# EasyEDA Pro project Car.eprj

# Schematic Schematic1
Board Name: Board1; Create Date: 2024-10-10
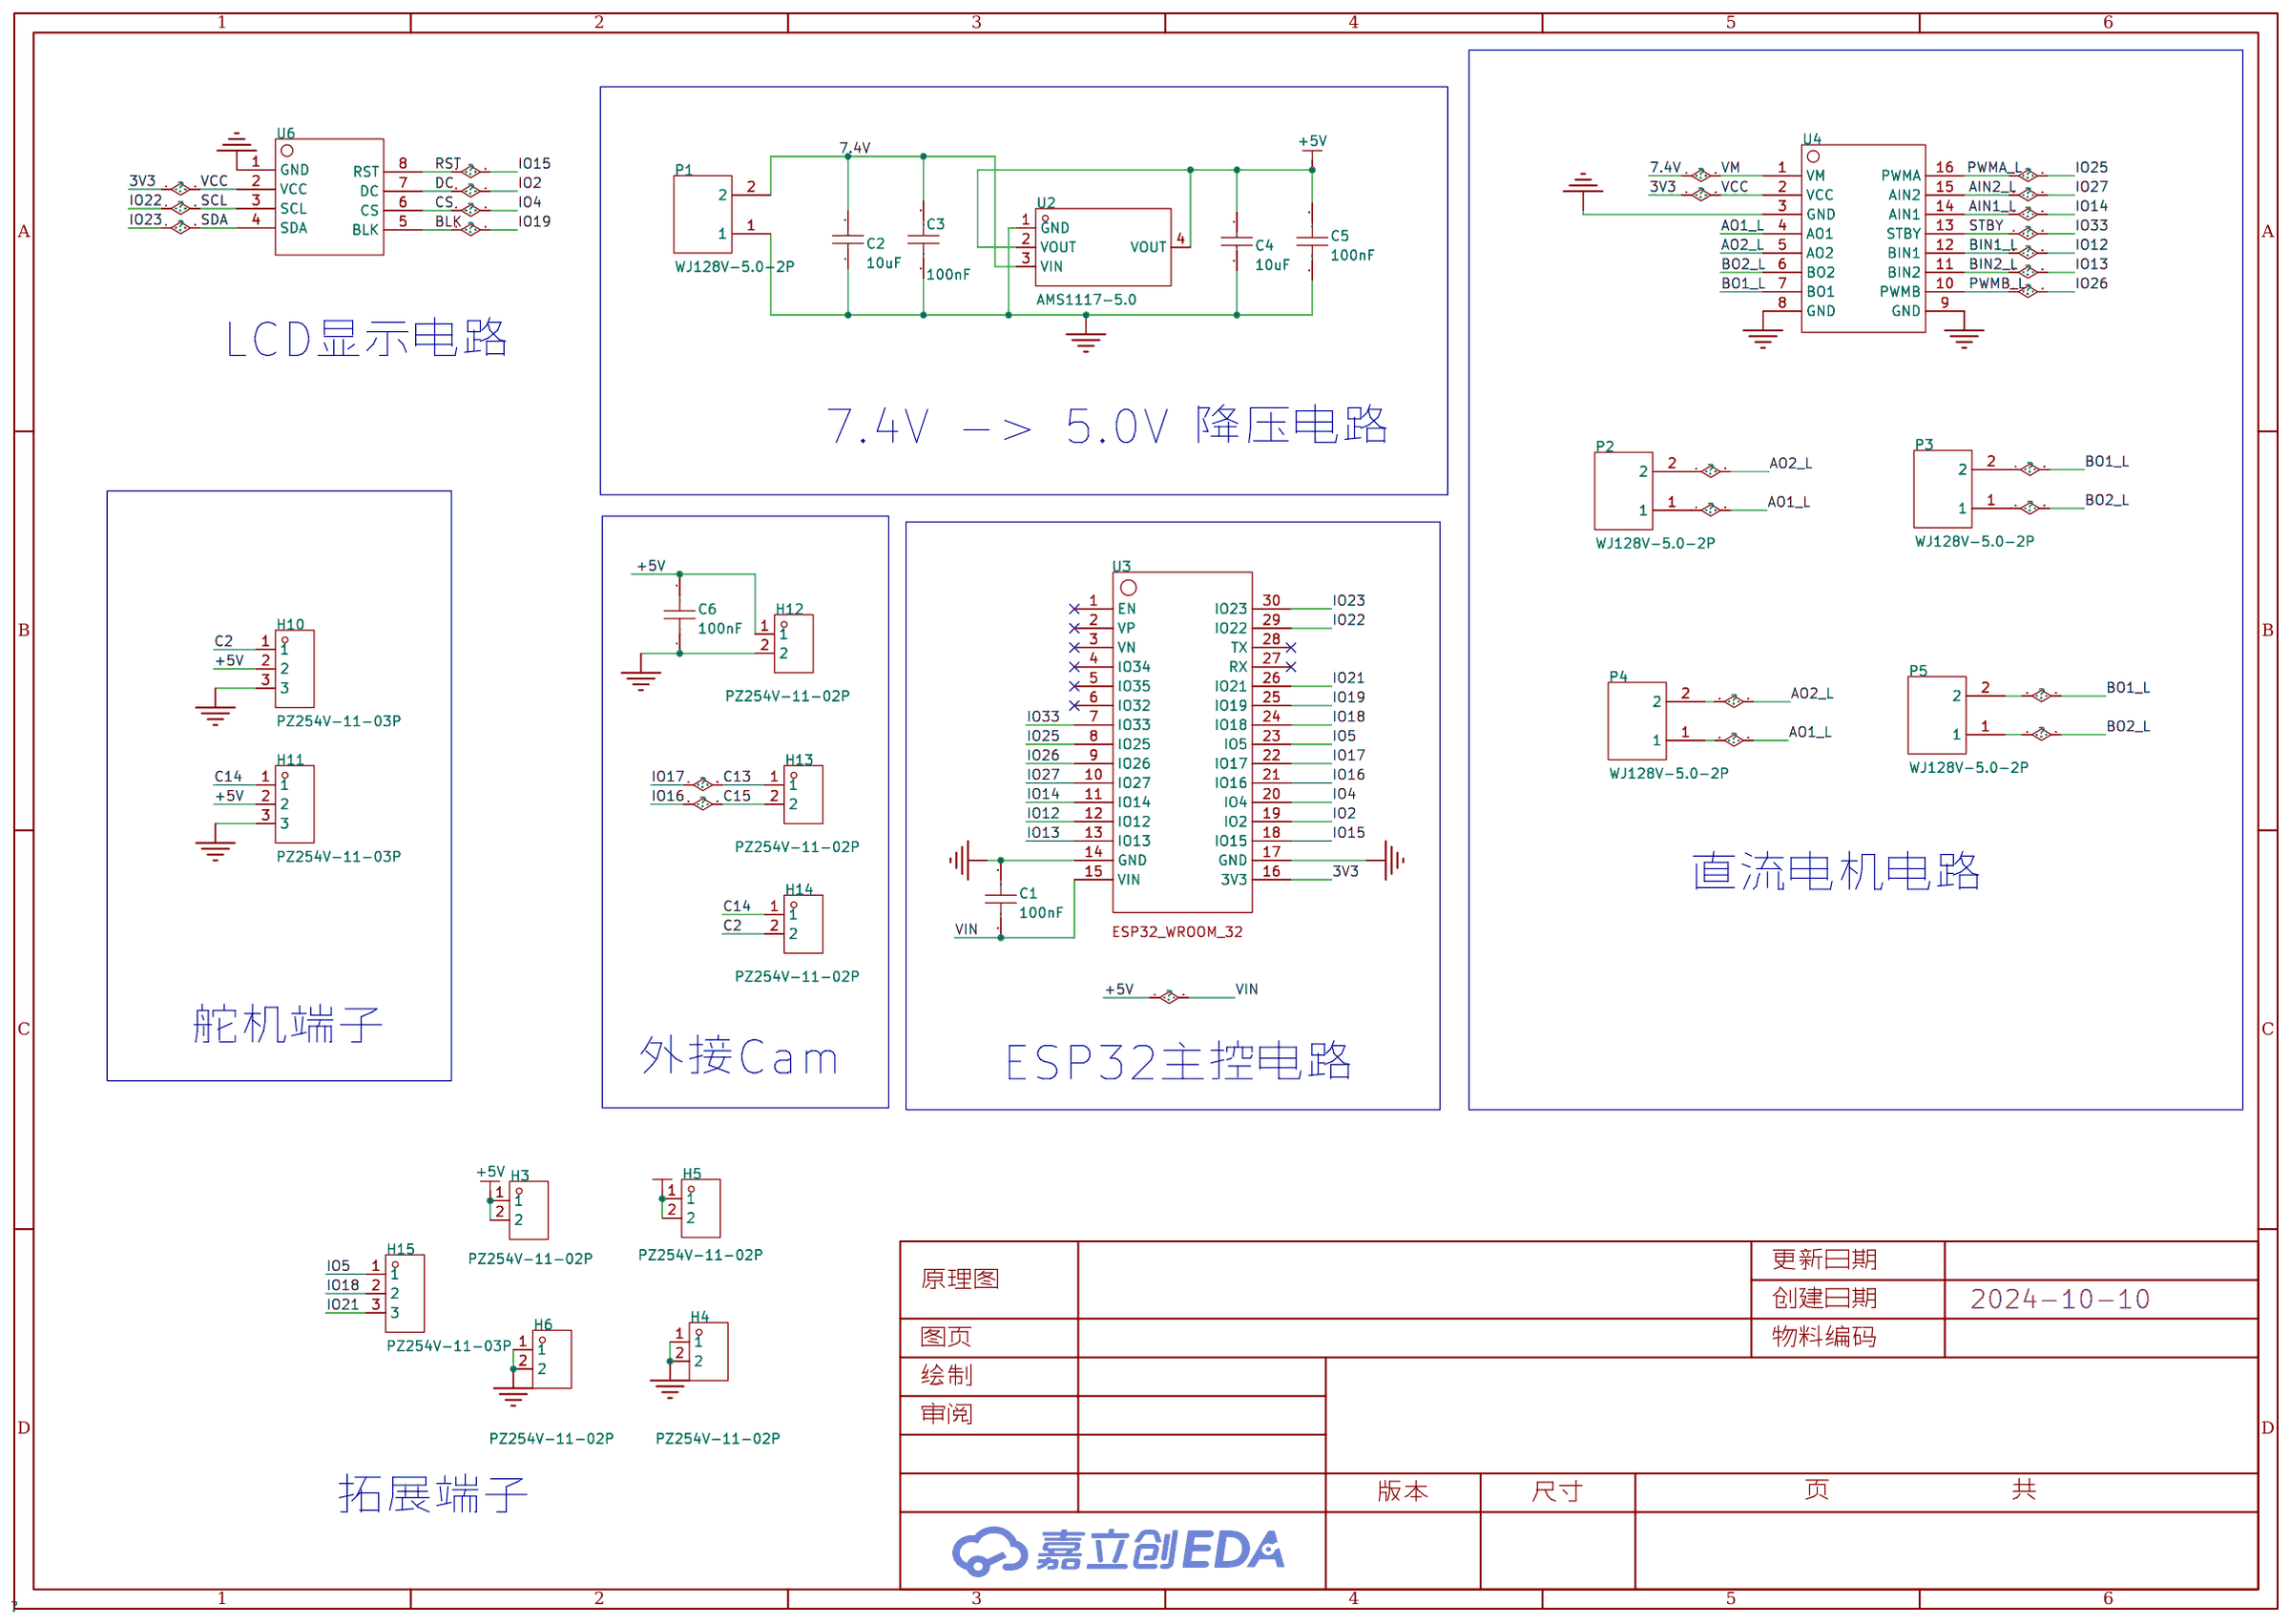
[diagram p0: schematic sheet]

## Parts
C1  100nF  [C0603]
C2  10uF  [C0805]
C3  100nF  [C0603]
C4  10uF  [C0805]
C5  100nF  [C0603]
C6  100nF  [C0603]
H3  PZ254V-11-02P  [HDR-TH_2P-P2.54-V-M]
H4  PZ254V-11-02P  [HDR-TH_2P-P2.54-V-M]
H5  PZ254V-11-02P  [HDR-TH_2P-P2.54-V-M]
H6  PZ254V-11-02P  [HDR-TH_2P-P2.54-V-M]
H10  PZ254V-11-03P  [HDR-TH_3P-P2.54-V-M]
H11  PZ254V-11-03P  [HDR-TH_3P-P2.54-V-M]
H12  PZ254V-11-02P  [HDR-TH_2P-P2.54-V-M]
H13  PZ254V-11-02P  [HDR-TH_2P-P2.54-V-M]
H14  PZ254V-11-02P  [HDR-TH_2P-P2.54-V-M]
H15  PZ254V-11-03P  [HDR-TH_3P-P2.54-V-M]
P1  WJ128V-5.0-2P  [CONN-TH_2P-P5.00_WJ128V-5.0-2P]
P2  WJ128V-5.0-2P  [CONN-TH_2P-P5.00_WJ128V-5.0-2P]
P3  WJ128V-5.0-2P  [CONN-TH_2P-P5.00_WJ128V-5.0-2P]
P4  WJ128V-5.0-2P  [CONN-TH_2P-P5.00_WJ128V-5.0-2P]
P5  WJ128V-5.0-2P  [CONN-TH_2P-P5.00_WJ128V-5.0-2P]
U2  AMS1117-5.0  [SOT-223_L6.5-W3.5-P2.30-LS7.0-BR]
U3  -  [ESP32_WROOM_32]
U4  -  [TB6612fng]
U6  -  [ST7735]

## Library data of the parts
C1 C3 C5 C6 = CGA0603X7R104K500JT: 容值:100nF;精度:±10%;额定电压:50V;材质(温度系数):X7R;; LCSC Part Name: 100nF ±10% 50V; Supplier Part: C6119867; Manufacturer: HRE(芯声); Supplier Footprint: 0603; JLCPCB Part Class: 扩展库; Supplier: LCSC; Tolerance: ±10%; Voltage Rated: 50V; Temperature Coefficient: X7R
C2 C4 = CL21A106KPFNNNE: 容值:10uF;精度:±10%;额定电压:10V;材质(温度系数):X5R;; LCSC Part Name: 10uF ±10% 10V; Supplier Part: C17024; Manufacturer: SAMSUNG(三星); Supplier Footprint: 0805; JLCPCB Part Class: 扩展库; Datasheet: https://atta.szlcsc.com/upload/public/pdf/source/20160218/1457707763339.pdf; Supplier: LCSC; Tolerance: ±10%; Voltage Rated: 10V; Temperature Coefficient: X5R
H3-H6 H12-H14 = PZ254V-11-02P: LCSC Part Name: 间距:2.54mm 1x2P 直插 方针; Supplier Part: C492401; Manufacturer: XFCN(兴飞); Supplier Footprint: 插件,P=2.54mm; Datasheet: https://atta.szlcsc.com/upload/public/pdf/source/20200309/C492401_A812433581A9B211A7FFA413ADDFF0E5.pdf; Supplier: LCSC; Pin Structure: 1x2P; Pitch: 2.54mm; Circluar Pins/Square Pins: 方针; Mounting Type: 直插; Number of Rows: 单排; Number of Pins: 2P; Length of Mating Pin: 6mm; Insulation Height: 2.5mm; Length of End Connection Pin: 3mm; Contact Material: 黄铜; Operating Temperature Range: -40℃~+105℃; Color: 黑色
H10 H11 H15 = PZ254V-11-03P: LCSC Part Name: 间距:2.54mm 1x3P 直插 方针; Supplier Part: C2937625; Manufacturer: XFCN(兴飞); Supplier Footprint: 插件,P=2.54mm; JLCPCB Part Class: 扩展库; Datasheet: https://atta.szlcsc.com/upload/public/pdf/source/20200309/C492402_8335C3D49C4E4C618838D59BB1D024C1.pdf; Supplier: LCSC; Pin Structure: 1x3P; Pitch: 2.54mm; Circluar Pins/Square Pins: 方针; Mounting Type: 直插; Number of Rows: 单排; Number of Pins: 3P; Current Rating (Max): 3A; Voltage Rating (Max): 250V; Length of Mating Pin: 6mm; Insulation Height: 2.5mm; Length of End Connection Pin: 3mm; Operating Temperature Range: -40℃~+105℃; Color: 黑色
P1-P5 = WJ128V-5.0-2P: LCSC Part Name: 5mm 1x2P 排数:1 每排P数:2 直插; Supplier Part: C8269; Manufacturer: KANGNEX(康奈克斯电气); Supplier Footprint: 插件,P=5mm; Datasheet: https://atta.szlcsc.com/upload/public/pdf/source/20191225/C8269_1FF44D6D2E83DB14A7CA266A410FD9AD.pdf; Supplier: LCSC; Structure: 1x2P; Pitch: 5mm; Color: 绿色; Mounting Style: 直插; Current Rating (Max): 20A; Voltage Rating (Max): 250V; Number of Pins: 2P; Number of Rows: 1; Wire Gauge - AWG: 12~22; Wire Gauge - mm2: 2.5; Number of PINs Per Row: 2; Operating Temperature Range: -40℃~+105℃
U2 = AMS1117-5.0_C6187: LCSC Part Name: 输入12V 输出5V 1A; Supplier Part: C6187; Manufacturer: AMS; Supplier Footprint: SOT-223; Datasheet: https://atta.szlcsc.com/upload/public/pdf/source/20230918/E4B716057EE82179D88E8A0894830D59.pdf; Supplier: LCSC; Output Type: 固定; Maximum Input Voltage: 12V; Output Voltage: 5V; MAX Output Current: 1A; Power Supply Rejection Ratio (PSRR): 68dB@(120Hz); Dropout Voltage: 1.3V@(1A); Output Polarity: 正极; Number of Outputs: 1
U3 = ESP32_WROOM_32
U4 = TB6612fng
U6 = ST7735

## Nets
3V3: H5.1 H5.2 U3.16(3V3) U4.2(VCC) U6.2(VCC)
7.4V: C2.2 C3.2 P1.2 U2.3(VIN) U4.1(VM)
+5V: C1.1 C4.2 C5.2 C6.2 H3.1 H3.2 H10.2 H11.2 H12.1 U2.2(VOUT) U2.4(VOUT) U3.15(VIN)
GND: C1.2 C2.1 C3.1 C4.1 C5.1 C6.1 H4.1 H4.2 H6.1 H6.2 H10.3 H11.3 H12.2 P1.1 U2.1(GND) U3.14(GND) U3.17(GND) U4.3(GND) U4.8(GND) U4.9(GND) U6.1(GND)
AIN1_L: U3.11(IO14) U4.14(AIN1)
AIN2_L: U3.10(IO27) U4.15(AIN2)
AO1_L: P2.1 P4.1 U4.4(AO1)
AO2_L: P2.2 P4.2 U4.5(AO2)
BIN1_L: U3.12(IO12) U4.12(BIN1)
BIN2_L: U3.13(IO13) U4.11(BIN2)
BLK: U3.25(IO19) U6.5(BLK)
BO1_L: P3.2 P5.2 U4.7(BO1)
BO2_L: P3.1 P5.1 U4.6(BO2)
C2: H10.1 H14.2
C13: H13.1 U3.22(IO17)
C14: H11.1 H14.1
C15: H13.2 U3.21(IO16)
CS: U3.20(IO4) U6.6(CS)
DC: U3.19(IO2) U6.7(DC)
IO5: H15.1 U3.23(IO5)
IO15: U3.18(IO15) U6.8(RST)
IO18: H15.2 U3.24(IO18)
IO21: H15.3 U3.26(IO21)
IO22: U3.29(IO22) U6.3(SCL)
IO23: U3.30(IO23) U6.4(SDA)
IO25: U3.8(IO25) U4.16(PWMA)
IO26: U3.9(IO26) U4.10(PWMB)
IO33: U3.7(IO33) U4.13(STBY)

Not connected (* = marked no-connect by the designer): U3 1(EN)* 2(VP)* 3(VN)* 4(IO34)* 5(IO35)* 6(IO32)* 27(RX)* 28(TX)*

## Notes on the sheet
- LCD显示电路
- 7.4V -> 5.0V 降压电路
- 直流电机电路
- 舵机端子
- 外接Cam
- ESP32主控电路
- 拓展端子

# Schematic Schematic1_1
Board Name: Board1; Create Date: 2024-10-10
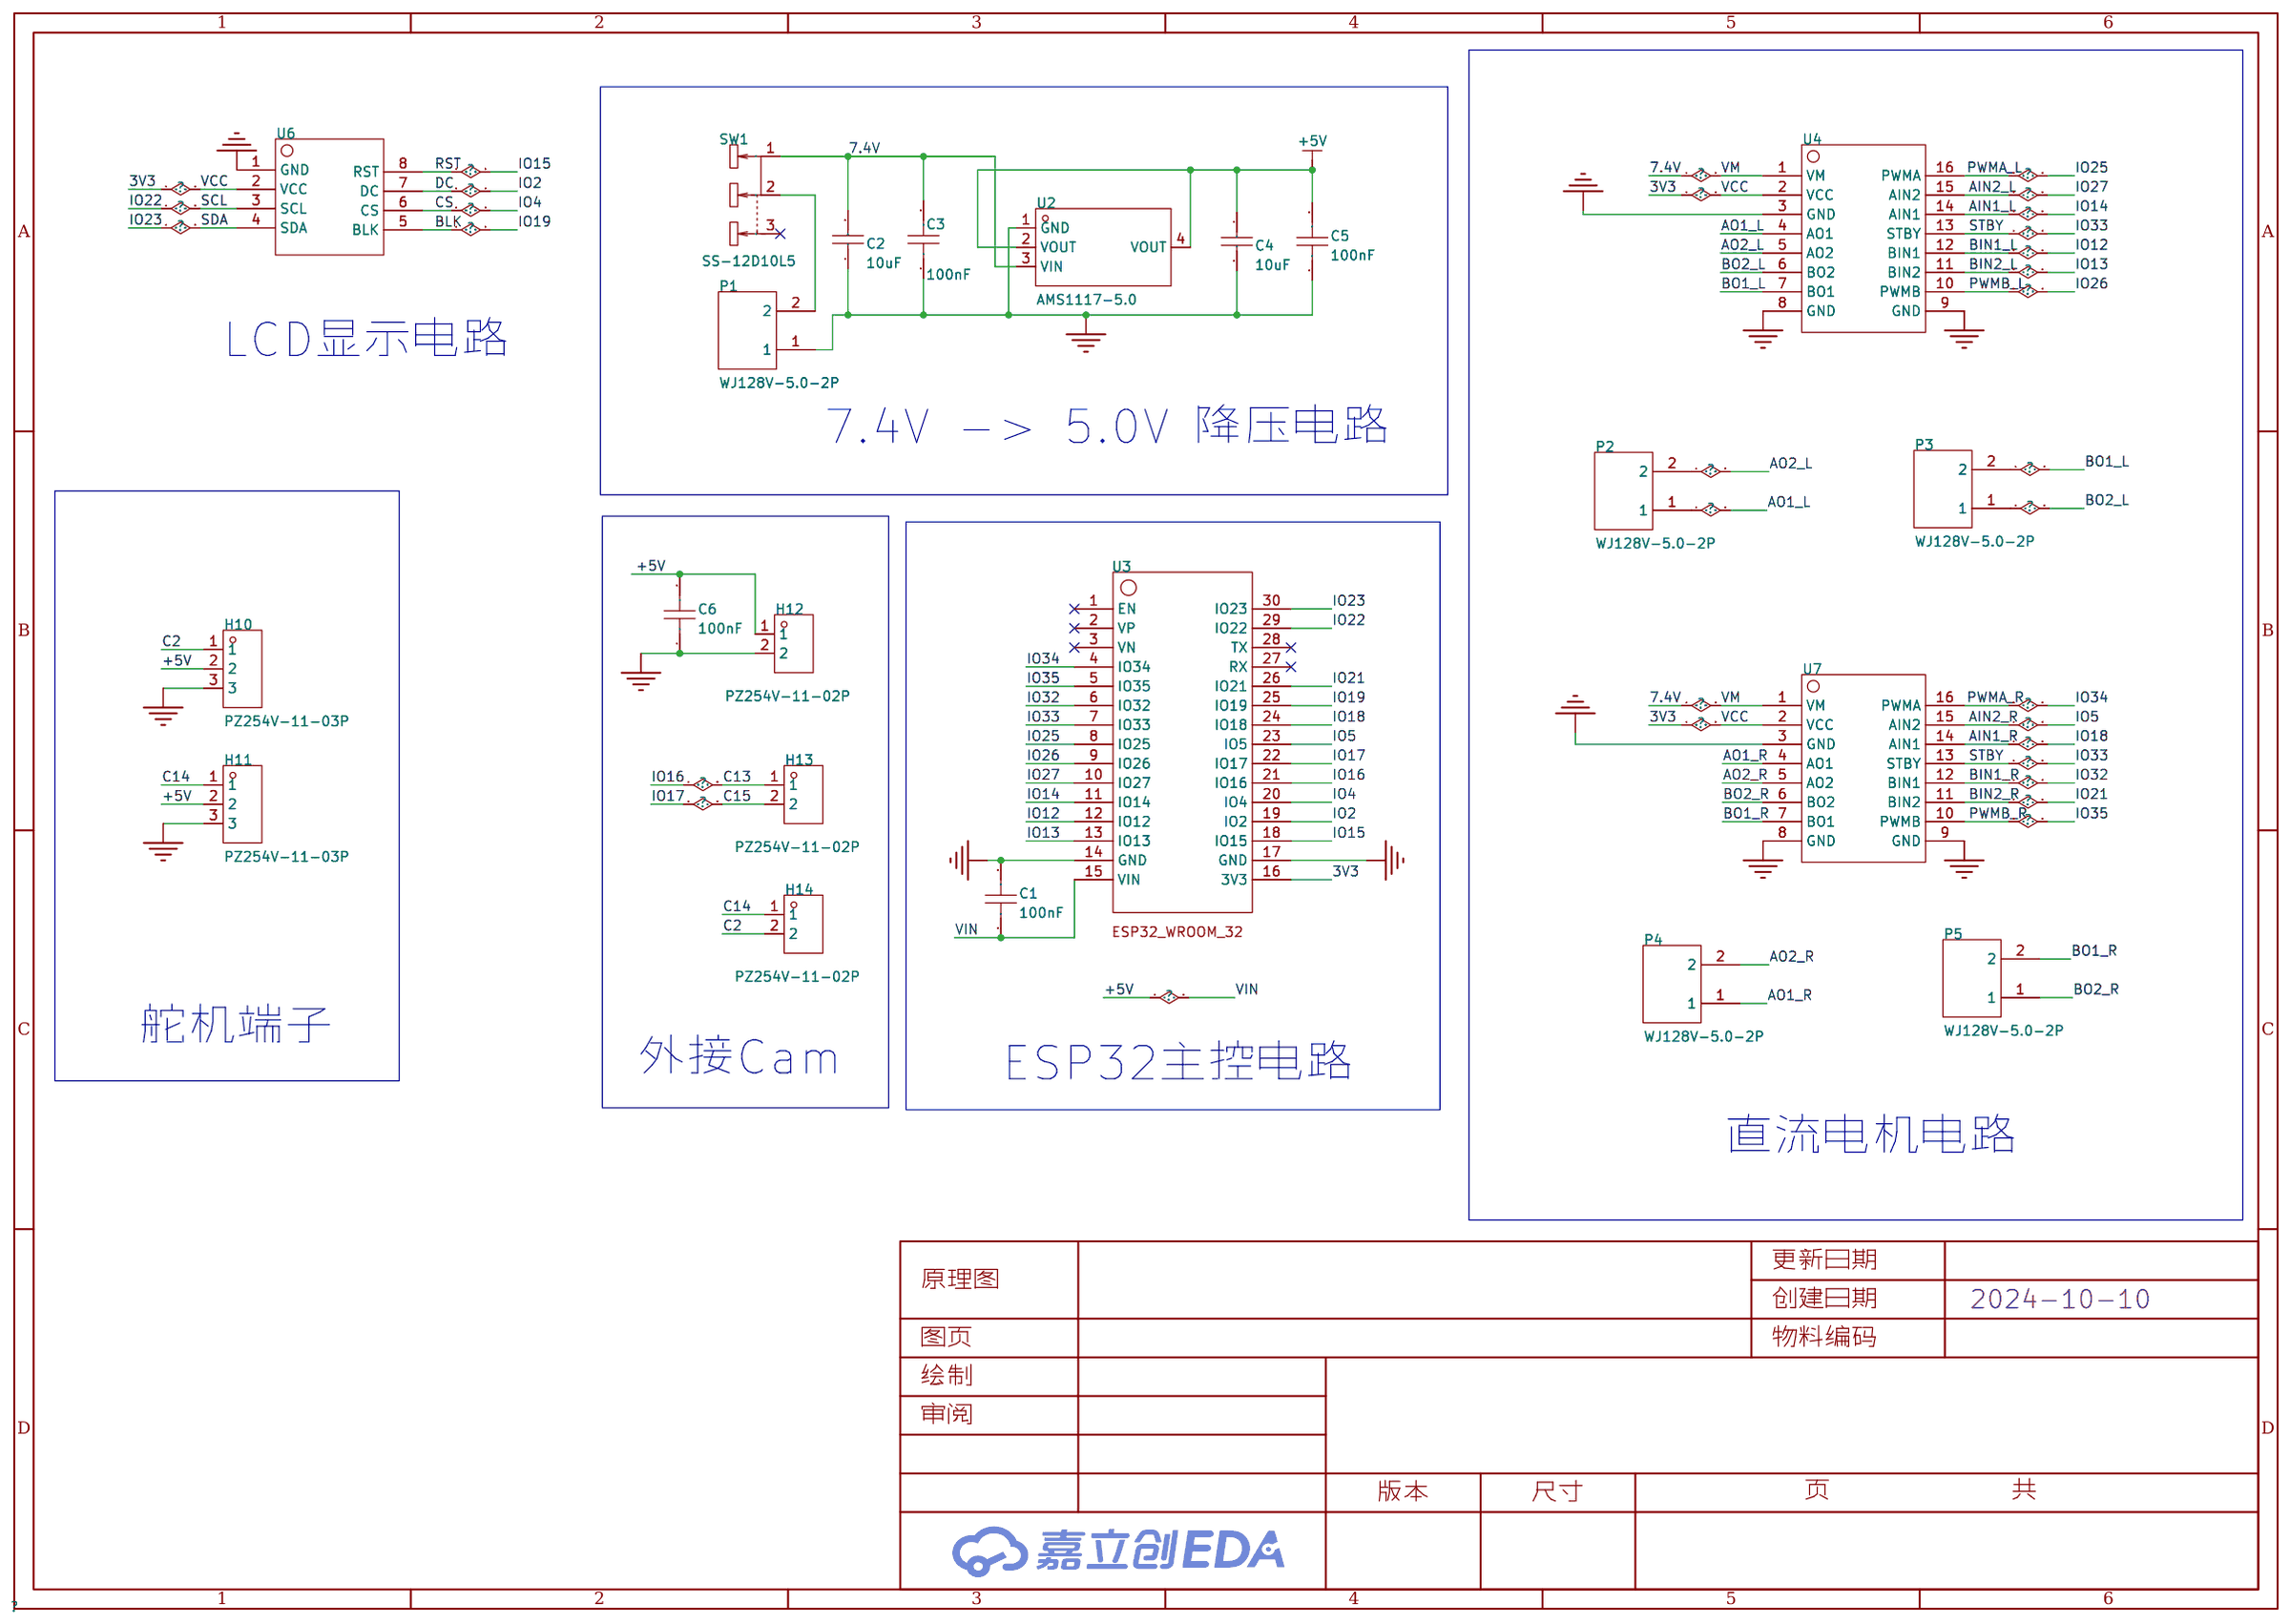
[diagram p1: schematic sheet]

## Parts
C1  100nF  [C0603]
C2  10uF  [C0805]
C3  100nF  [C0603]
C4  10uF  [C0805]
C5  100nF  [C0603]
C6  100nF  [C0603]
H10  PZ254V-11-03P  [HDR-TH_3P-P2.54-V-M]
H11  PZ254V-11-03P  [HDR-TH_3P-P2.54-V-M]
H12  PZ254V-11-02P  [HDR-TH_2P-P2.54-V-M]
H13  PZ254V-11-02P  [HDR-TH_2P-P2.54-V-M]
H14  PZ254V-11-02P  [HDR-TH_2P-P2.54-V-M]
P1  WJ128V-5.0-2P  [CONN-TH_2P-P5.00_WJ128V-5.0-2P]
P2  WJ128V-5.0-2P  [CONN-TH_2P-P5.00_WJ128V-5.0-2P]
P3  WJ128V-5.0-2P  [CONN-TH_2P-P5.00_WJ128V-5.0-2P]
P4  WJ128V-5.0-2P  [CONN-TH_2P-P5.00_WJ128V-5.0-2P]
P5  WJ128V-5.0-2P  [CONN-TH_2P-P5.00_WJ128V-5.0-2P]
SW1  SS-12D10L5  [SW-TH_SS-12D10L5]
U2  AMS1117-5.0  [SOT-223_L6.5-W3.5-P2.30-LS7.0-BR]
U3  -  [ESP32_WROOM_32]
U4  -  [TB6612fng]
U6  -  [ST7735]
U7  -  [TB6612fng]

## Library data of the parts
C1 C3 C5 C6 = CGA0603X7R104K500JT: 容值:100nF;精度:±10%;额定电压:50V;材质(温度系数):X7R;; LCSC Part Name: 100nF ±10% 50V; Supplier Part: C6119867; Manufacturer: HRE(芯声); Supplier Footprint: 0603; JLCPCB Part Class: 扩展库; Supplier: LCSC; Tolerance: ±10%; Voltage Rated: 50V; Temperature Coefficient: X7R
C2 C4 = CL21A106KPFNNNE: 容值:10uF;精度:±10%;额定电压:10V;材质(温度系数):X5R;; LCSC Part Name: 10uF ±10% 10V; Supplier Part: C17024; Manufacturer: SAMSUNG(三星); Supplier Footprint: 0805; JLCPCB Part Class: 扩展库; Datasheet: https://atta.szlcsc.com/upload/public/pdf/source/20160218/1457707763339.pdf; Supplier: LCSC; Tolerance: ±10%; Voltage Rated: 10V; Temperature Coefficient: X5R
H10 H11 = PZ254V-11-03P: LCSC Part Name: 间距:2.54mm 1x3P 直插 方针; Supplier Part: C2937625; Manufacturer: XFCN(兴飞); Supplier Footprint: 插件,P=2.54mm; JLCPCB Part Class: 扩展库; Datasheet: https://atta.szlcsc.com/upload/public/pdf/source/20200309/C492402_8335C3D49C4E4C618838D59BB1D024C1.pdf; Supplier: LCSC; Pin Structure: 1x3P; Pitch: 2.54mm; Circluar Pins/Square Pins: 方针; Mounting Type: 直插; Number of Rows: 单排; Number of Pins: 3P; Current Rating (Max): 3A; Voltage Rating (Max): 250V; Length of Mating Pin: 6mm; Insulation Height: 2.5mm; Length of End Connection Pin: 3mm; Operating Temperature Range: -40℃~+105℃; Color: 黑色
H12-H14 = PZ254V-11-02P: LCSC Part Name: 间距:2.54mm 1x2P 直插 方针; Supplier Part: C492401; Manufacturer: XFCN(兴飞); Supplier Footprint: 插件,P=2.54mm; Datasheet: https://atta.szlcsc.com/upload/public/pdf/source/20200309/C492401_A812433581A9B211A7FFA413ADDFF0E5.pdf; Supplier: LCSC; Pin Structure: 1x2P; Pitch: 2.54mm; Circluar Pins/Square Pins: 方针; Mounting Type: 直插; Number of Rows: 单排; Number of Pins: 2P; Length of Mating Pin: 6mm; Insulation Height: 2.5mm; Length of End Connection Pin: 3mm; Contact Material: 黄铜; Operating Temperature Range: -40℃~+105℃; Color: 黑色
P1-P5 = WJ128V-5.0-2P: LCSC Part Name: 5mm 1x2P 排数:1 每排P数:2 直插; Supplier Part: C8269; Manufacturer: KANGNEX(康奈克斯电气); Supplier Footprint: 插件,P=5mm; Datasheet: https://atta.szlcsc.com/upload/public/pdf/source/20191225/C8269_1FF44D6D2E83DB14A7CA266A410FD9AD.pdf; Supplier: LCSC; Structure: 1x2P; Pitch: 5mm; Color: 绿色; Mounting Style: 直插; Current Rating (Max): 20A; Voltage Rating (Max): 250V; Number of Pins: 2P; Number of Rows: 1; Wire Gauge - AWG: 12~22; Wire Gauge - mm2: 2.5; Number of PINs Per Row: 2; Operating Temperature Range: -40℃~+105℃
SW1 = SS-12D10L5: LCSC Part Name: 柄长5mm 直插双档 滑动开关; Supplier Part: C319012; Manufacturer: XKB Connectivity(中国星坤); Supplier Footprint: 插件; Datasheet: https://atta.szlcsc.com/upload/public/pdf/source/20211009/D6412F37AABE6F9459A6EE7FA4DAEADB.pdf; Supplier: LCSC; Circuit: 单刀双掷; Actuator Style: 矩形柱状; Pin Style: PC引脚; Switch Length: 13mm; Switch Width: 6.8mm; Switch Height: 6.4mm; Mounting Style: 直插; Actuator Color: 黑色; Current Rating (DC): 3A; Voltage Rating (DC): 125V; Current Rating (AC): 3A; Voltage Rating (AC): 125V; Mechanical Life: 1万次; Operating Temperature: -40℃~+85℃
U2 = AMS1117-5.0_C6187: LCSC Part Name: 输入12V 输出5V 1A; Supplier Part: C6187; Manufacturer: AMS; Supplier Footprint: SOT-223; Datasheet: https://atta.szlcsc.com/upload/public/pdf/source/20230918/E4B716057EE82179D88E8A0894830D59.pdf; Supplier: LCSC; Output Type: 固定; Maximum Input Voltage: 12V; Output Voltage: 5V; MAX Output Current: 1A; Power Supply Rejection Ratio (PSRR): 68dB@(120Hz); Dropout Voltage: 1.3V@(1A); Output Polarity: 正极; Number of Outputs: 1
U3 = ESP32_WROOM_32
U4 U7 = TB6612fng
U6 = ST7735

## Nets
3V3: U3.16(3V3) U4.2(VCC) U6.2(VCC) U7.2(VCC)
7.4V: C2.2 C3.2 SW1.1 U2.3(VIN) U4.1(VM) U7.1(VM)
+5V: C1.1 C4.2 C5.2 C6.2 H10.2 H11.2 H12.1 U2.2(VOUT) U2.4(VOUT) U3.15(VIN)
GND: C1.2 C2.1 C3.1 C4.1 C5.1 C6.1 H10.3 H11.3 H12.2 P1.1 U2.1(GND) U3.14(GND) U3.17(GND) U4.3(GND) U4.8(GND) U4.9(GND) U6.1(GND) U7.3(GND) U7.8(GND) U7.9(GND)
AIN1_L: U3.11(IO14) U4.14(AIN1)
AIN1_R: U3.24(IO18) U7.14(AIN1)
AIN2_L: U3.10(IO27) U4.15(AIN2)
AIN2_R: U3.23(IO5) U7.15(AIN2)
AO1_L: P2.1 U4.4(AO1)
AO1_R: P4.1 U7.4(AO1)
AO2_L: P2.2 U4.5(AO2)
AO2_R: P4.2 U7.5(AO2)
BIN1_L: U3.12(IO12) U4.12(BIN1)
BIN1_R: U3.6(IO32) U7.12(BIN1)
BIN2_L: U3.13(IO13) U4.11(BIN2)
BIN2_R: U3.26(IO21) U7.11(BIN2)
BLK: U3.25(IO19) U6.5(BLK)
BO1_L: P3.2 U4.7(BO1)
BO1_R: P5.2 U7.7(BO1)
BO2_L: P3.1 U4.6(BO2)
BO2_R: P5.1 U7.6(BO2)
C2: H10.1 H14.2
C13: H13.1 U3.21(IO16)
C14: H11.1 H14.1
C15: H13.2 U3.22(IO17)
CS: U3.20(IO4) U6.6(CS)
DC: U3.19(IO2) U6.7(DC)
IO15: U3.18(IO15) U6.8(RST)
IO22: U3.29(IO22) U6.3(SCL)
IO23: U3.30(IO23) U6.4(SDA)
IO25: U3.8(IO25) U4.16(PWMA)
IO26: U3.9(IO26) U4.10(PWMB)
IO33: U3.7(IO33) U4.13(STBY) U7.13(STBY)
IO34: U3.4(IO34) U7.16(PWMA)
IO35: U3.5(IO35) U7.10(PWMB)
$1N1319: P1.2 SW1.2

Not connected (* = marked no-connect by the designer): SW1 3*; U3 1(EN)* 2(VP)* 3(VN)* 27(RX)* 28(TX)*

## Notes on the sheet
- LCD显示电路
- 7.4V -> 5.0V 降压电路
- 舵机端子
- 外接Cam
- ESP32主控电路
- 直流电机电路

# Board PCB1
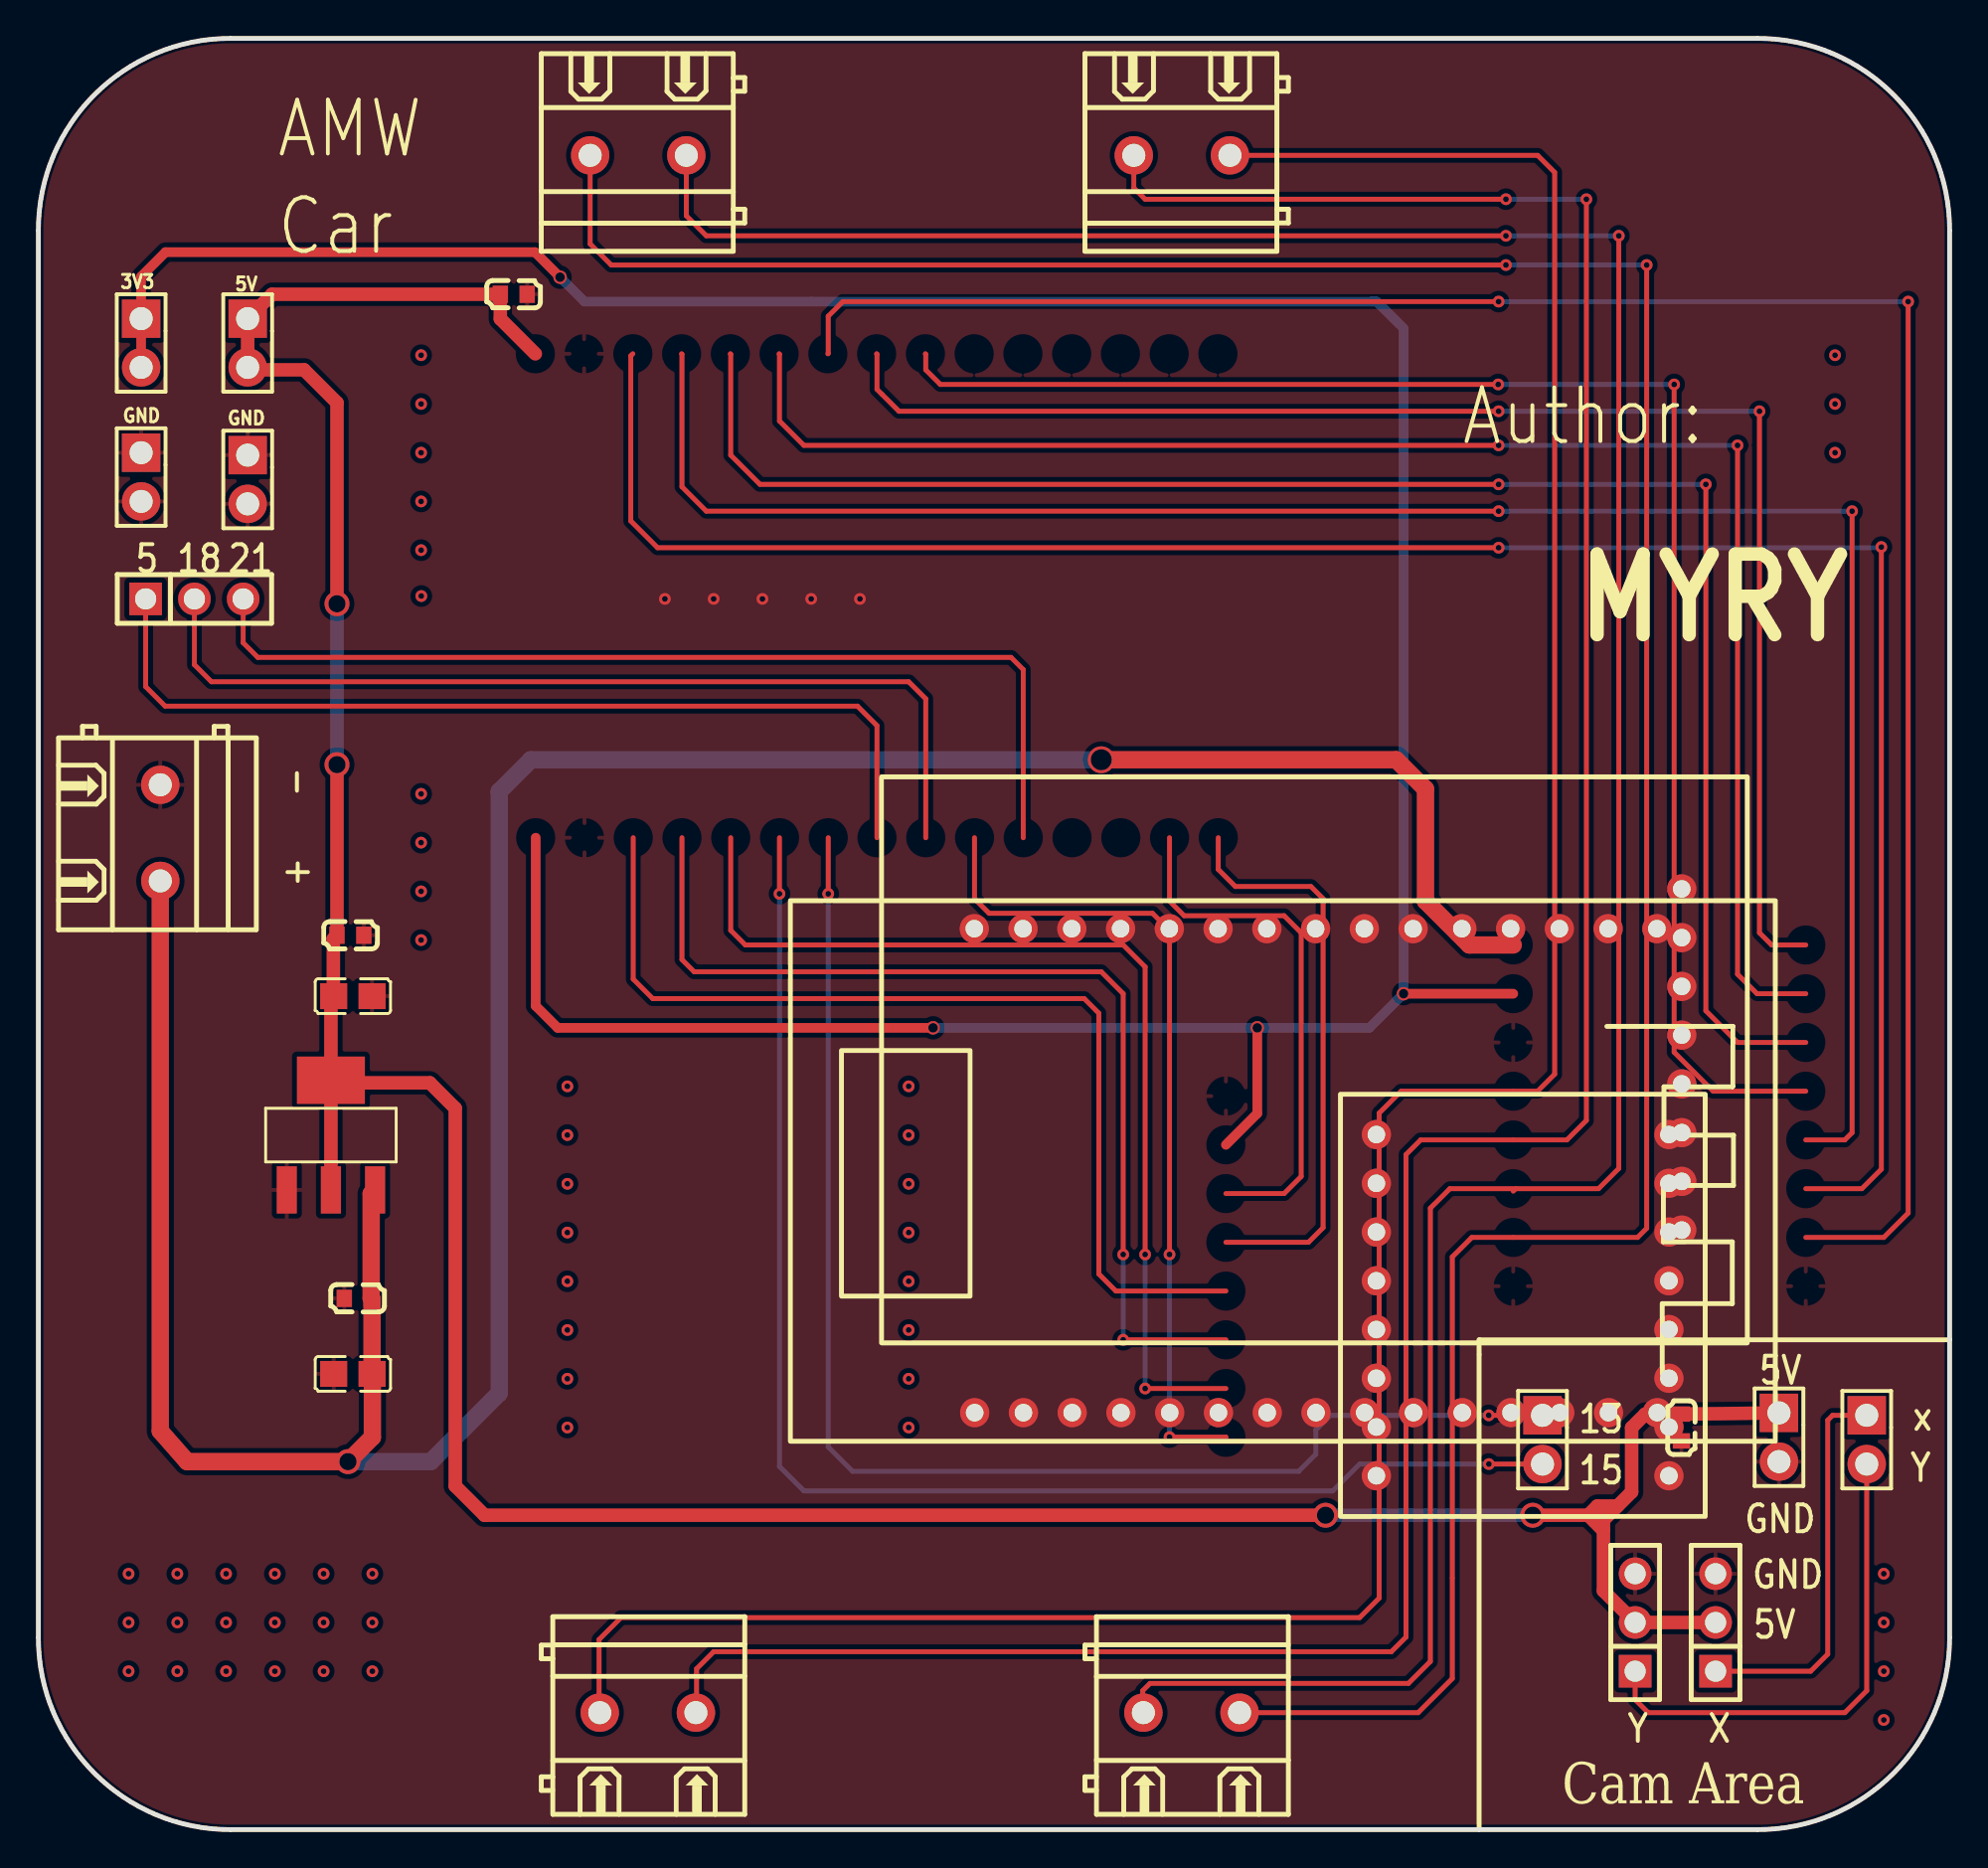
[diagram p2: board, top side]
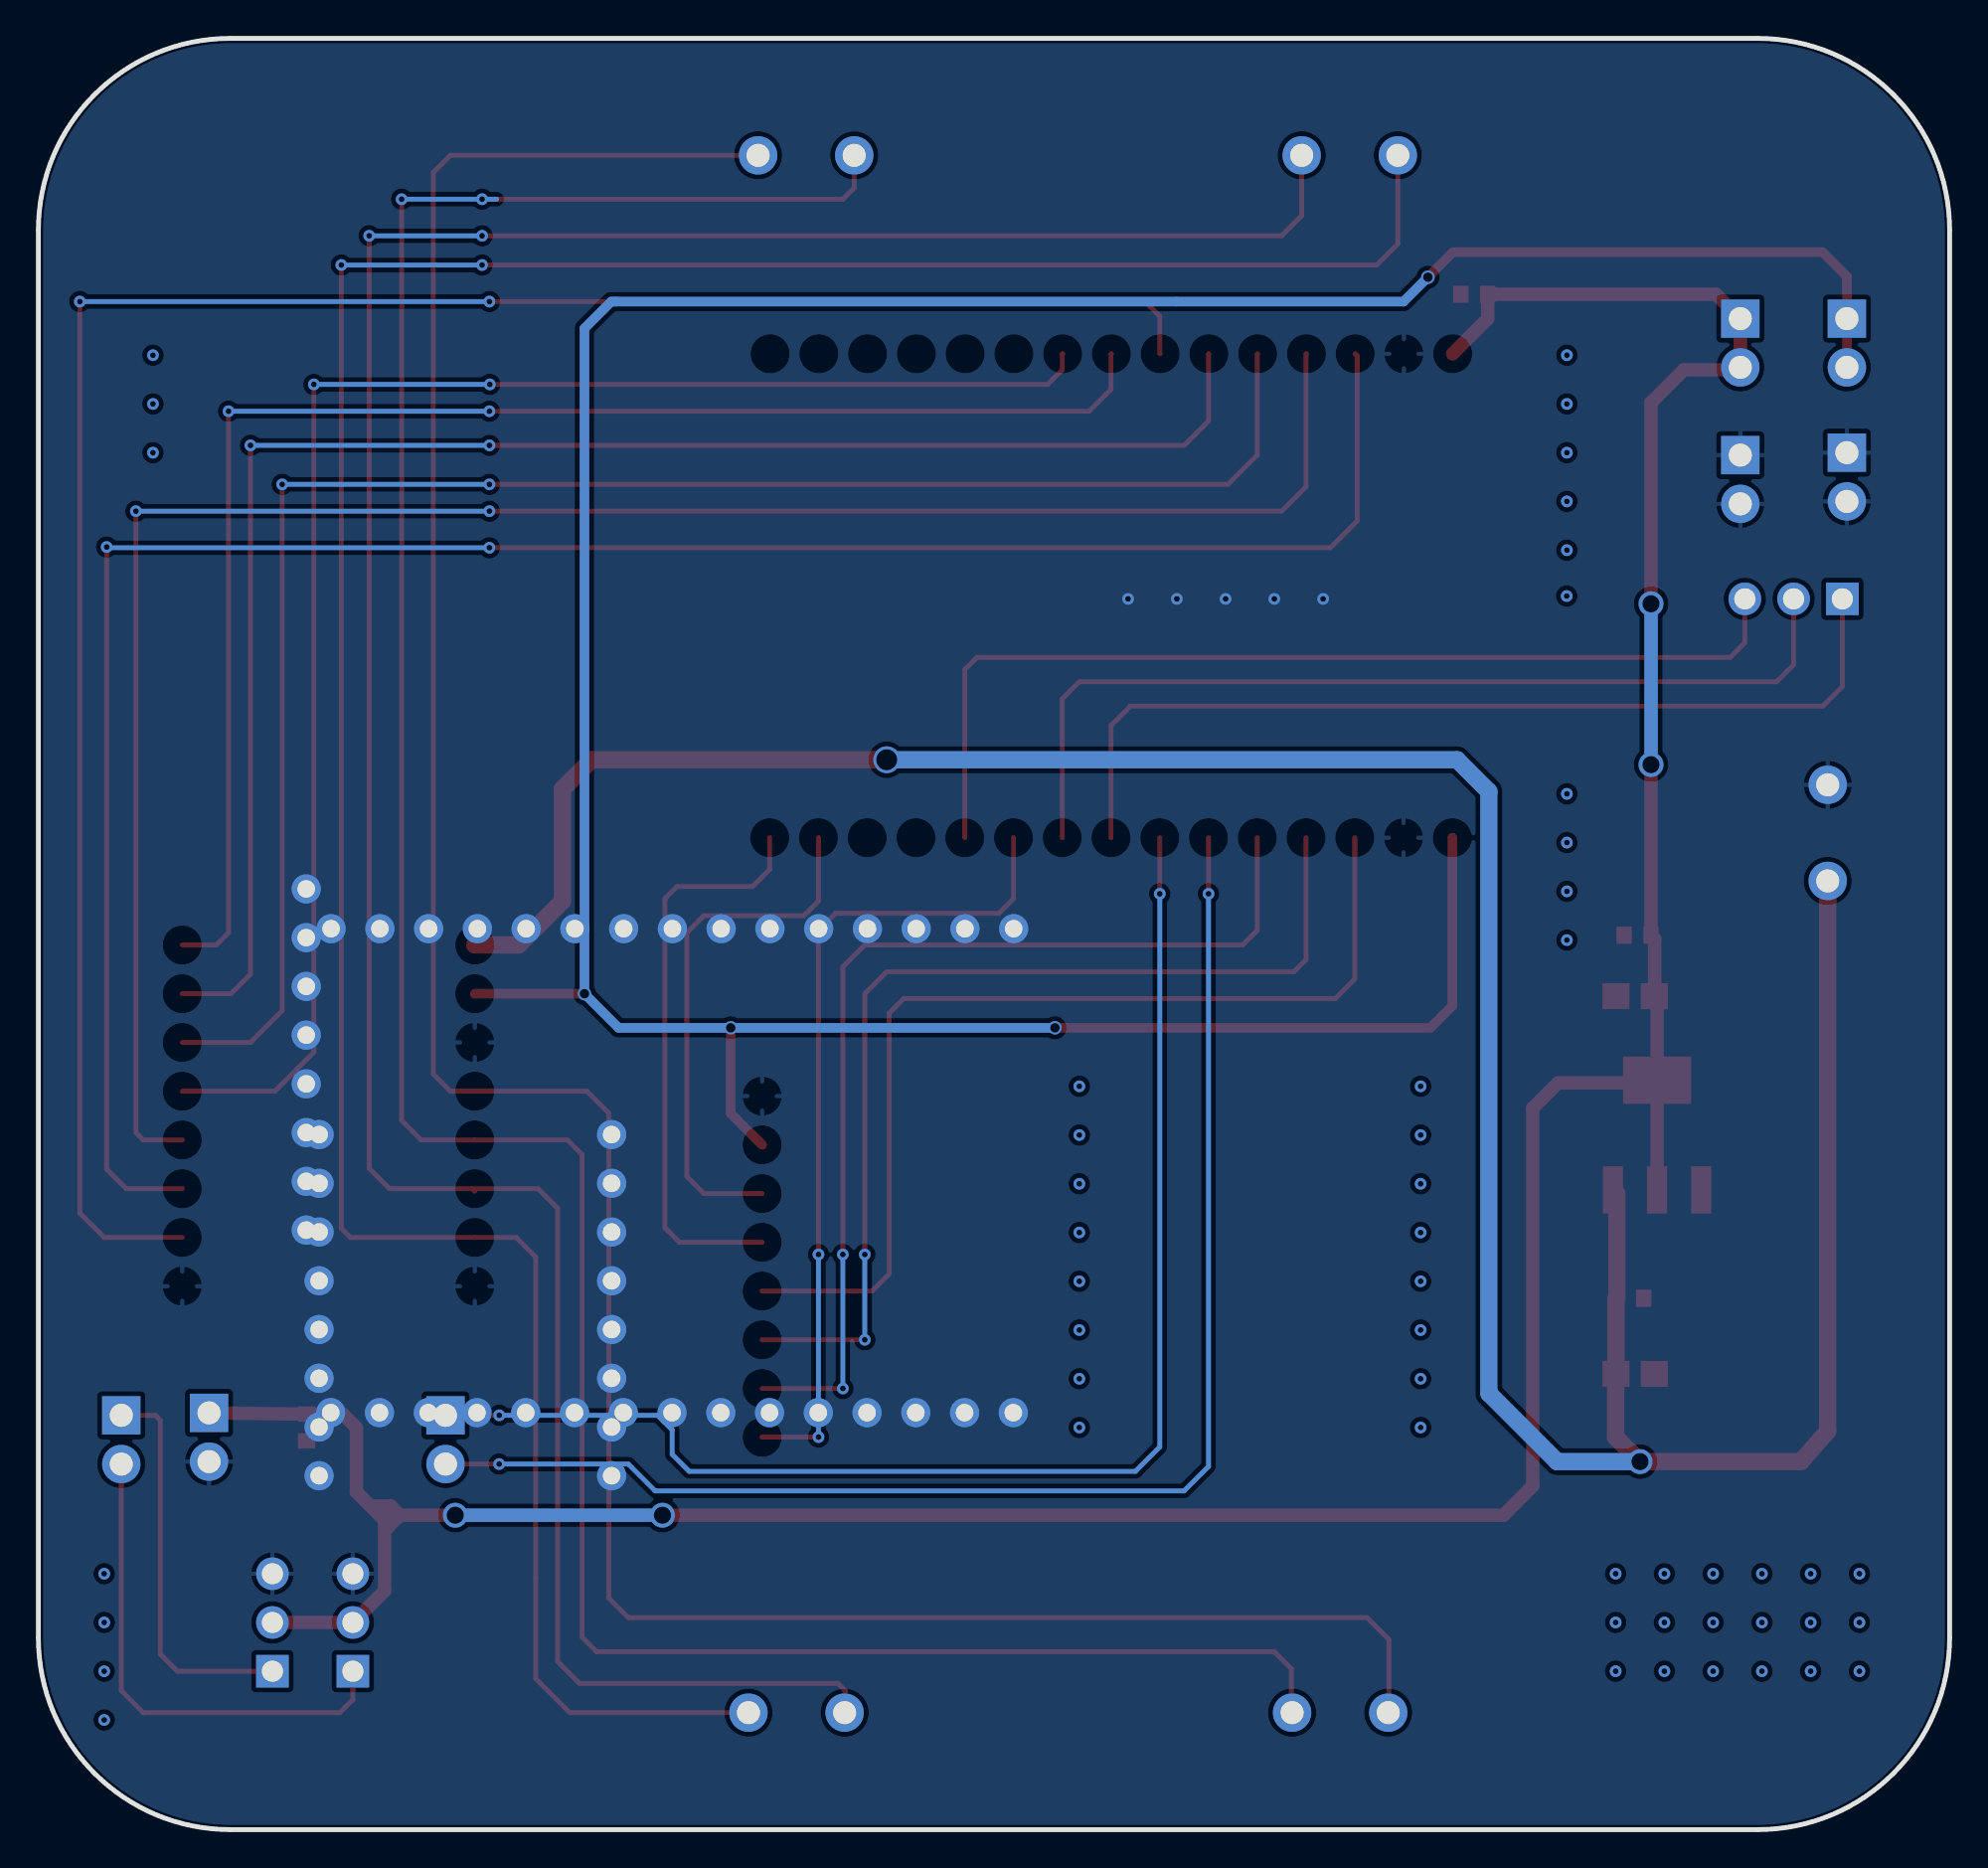
[diagram p3: board, bottom side, seen from below]

Outline 99.57 x 93.34 mm; copper layers: Top Layer, Bottom Layer. Coordinates in mm from the lower left corner of the outline.
Outline path: 0,83.35 0,10 arc(2.93,2.93) 10,0 89.57,0 arc(96.64,2.93) 99.57,10 99.57,83.35 arc(96.64,90.42) 89.57,93.34 10,93.34 arc(2.93,90.42) 0,83.35
Stack: Top Layer 0.035mm / Dielectric1 1.51mm FR4 er 4.5 / Bottom Layer 0.035mm

## Design rules (mm)
template: JLCPCB Capability(Two Layers Board)
spacing copperThickness1oz (default): track to track 0.102, other pairs 0.152 to 0.3
spacing copperThickness2oz: track to track 0.203, other pairs 0.152 to 0.3
track width copperThickness1oz (default): min 0.127, default 0.254, max 2.54
track width copperThickness2oz: min 0.203, default 0.254, max 2.54
differential pair differentialPair (default): width min 0.127, default 0.254, max 2.54; gap min 0.152, default 0.152
via viaSize (default): diameter min 0.5, default 0.61, max 10; hole min 0.3, default 0.305, max 6.3

## Placement (name value [footprint] x y rotation side)
3V3  PZ254V-11-02P  [HDR-TH_2P-P2.54-V-M]  5.35 77.47 270 top
5V  PZ254V-11-02P  [HDR-TH_2P-P2.54-V-M]  10.9 77.47 270 top
C1  100nF  [C0603]  24.77 80.01 0 top
C2  10uF  [C0805]  16.38 23.75 0 top
C3  100nF  [C0603]  16.64 27.69 0 top
C4  10uF  [C0805]  16.38 43.43 180 top
C5  100nF  [C0603]  16.26 46.61 180 top
C6  100nF  [C0603]  85.6 20.96 90 top
GND  -  [HDR-TH_2P-P2.54-V-M]  10.9 70.36 270 top
GND#2  -  [HDR-TH_2P-P2.54-V-M]  5.35 70.49 270 top
H10  PZ254V-11-03P  [HDR-TH_3P-P2.54-V-M]  83.19 10.8 90 top
H11  PZ254V-11-03P  [HDR-TH_3P-P2.54-V-M]  87.38 10.8 90 top
H12  PZ254V-11-02P  [HDR-TH_2P-P2.54-V-M]  90.68 20.45 270 top
H13  PZ254V-11-02P  [HDR-TH_2P-P2.54-V-M]  78.36 20.32 270 top
H14  PZ254V-11-02P  [HDR-TH_2P-P2.54-V-M]  95.25 20.32 270 top
H15  PZ254V-11-03P  [HDR-TH_3P-P2.54-V-M]  8.13 64.14 0 top
P1  WJ128V-5.0-2P  [CONN-TH_2P-P5.00_WJ128V-5.0-2P]  6.35 51.94 270 top
P2  WJ128V-5.0-2P  [CONN-TH_2P-P5.00_WJ128V-5.0-2P]  59.57 87.25 180 top
P3  WJ128V-5.0-2P  [CONN-TH_2P-P5.00_WJ128V-5.0-2P]  31.25 87.25 180 top
P4  WJ128V-5.0-2P  [CONN-TH_2P-P5.00_WJ128V-5.0-2P]  31.75 6.1 0 top
P5  WJ128V-5.0-2P  [CONN-TH_2P-P5.00_WJ128V-5.0-2P]  60.07 6.1 0 top
U2  AMS1117-5.0  [SOT-223_L6.5-W3.5-P2.30-LS7.0-BR]  15.24 36.2 270 top
U3  -  [ESP32_WROOM_32]  56.39 51.69 270 top
U4  -  [TB6612fng]  76.83 28.32 0 top
U6  -  [ST7735]  62.86 38.23 270 top

## Footprints (pads in the part's own frame, mm; a bottom-side part is the same pattern mirrored in y, then rotated)
C0603
  rect 0.8x0.9 smd: 1(-0.7,0) 2(0.7,0)
C0805
  rect 1.41x1.35 smd: 1(-1,0) 2(1,0)
CONN-TH_2P-P5.00_WJ128V-5.0-2P
  round 2 hole 1.2: 1(-2.505,0) 2(2.505,0)
ESP32_WROOM_32
  round 1.524 hole 0.914: 1(4.74,27.93) 2(4.74,25.39) 3(4.74,22.85) 4(4.74,20.31) 5(4.74,17.77) 6(4.74,15.23) 7(4.74,12.69) 8(4.74,10.15) 9(4.74,7.61) 10(4.74,5.07) 11(4.74,2.53) 12(4.74,-0.01) 13(4.74,-2.55) 14(4.74,-5.09) 15(4.74,-7.63) 16(29.96,-7.61) 17(29.96,-5.07) 18(29.96,-2.53) 19(29.96,0.01) 20(29.96,2.55) 21(29.96,5.09) 22(29.96,7.63) 23(29.96,10.17) 24(29.96,12.71) 25(29.96,15.25) 26(29.96,17.79) 27(29.96,20.33) 28(29.96,22.87) 29(29.96,25.41) 30(29.96,27.95)
HDR-TH_2P-P2.54-V-M
  rect 2x2 hole 1.2: 1(-1.27,0)
  round 2 hole 1.2: 2(1.27,0)
HDR-TH_3P-P2.54-V-M
  rect 1.7x1.7 hole 1.1: 1(-2.54,0)
  round 1.7 hole 1.1: 2(0,0) 3(2.54,0)
SOT-223_L6.5-W3.5-P2.30-LS7.0-BR
  rect 2.465x1.05 smd: 1(2.857,-2.3) 2(2.857,0) 3(2.857,2.3)
  rect 2.465x3.54 smd: 4(-2.857,0)
ST7735
  round 1.524 hole 0.914: 1(-10.795,22.749) 2(-8.255,22.749) 3(-5.715,22.749) 4(-3.175,22.749) 5(6.985,22.749) 6(4.445,22.749) 7(1.905,22.749) 8(-0.635,22.749)
TB6612fng
  round 1.524 hole 0.914: 1(-7.13,7.9) 2(-7.13,5.36) 3(-7.13,2.82) 4(-7.13,0.28) 5(-7.13,-2.26) 6(-7.13,-4.8) 7(-7.13,-7.34) 8(-7.13,-9.88) 9(8.11,-9.88) 10(8.11,-7.34) 11(8.11,-4.8) 12(8.11,-2.26) 13(8.11,0.28) 14(8.11,2.82) 15(8.11,5.36) 16(8.11,7.9)

## Nets
As in the schematic, except:
3V3: 3V3.1 3V3.2 U3.16 U4.2 U6.2
+5V: 5V.1 5V.2 C1.1 C4.2 C5.2 C6.2 H10.2 H11.2 H12.1 U2.2 U2.4 U3.15
GND: C1.2 C2.1 C3.1 C4.1 C5.1 C6.1 GND.1 GND.2 GND#2.1 GND#2.2 H10.3 H11.3 H12.2 P1.1 U2.1 U3.14 U3.17 U4.3 U4.8 U4.9 U6.1

Pads without a net: U3 1 2 3 4 5 6 27 28

## Via types
v1: diameter 0.61, hole 0.305, Top Layer to Bottom Layer, 86 vias
v2: diameter 1.3, hole 0.9, Top Layer to Bottom Layer, 5 vias
v3: diameter 1.4, hole 1.1, Top Layer to Bottom Layer, 1 via
v4: diameter 0.7, hole 0.5, Top Layer to Bottom Layer, 4 vias

## Routing (per net, layer and track width the routed paths; a pad name or vN(x,y) marks a point on that pad's centre or on a via; arc(x,y) is an arc through that point)
3V3: length 175.1
  Top Layer w0.5: 5.35,76.2 3V3.1 5.35,80.94 6.62,82.21 25.87,82.21 v4(27.18,80.9) ; 25.91,51.69 25.91,42.93 27.05,41.78 v4(46.61,41.78) ; v4(63.5,41.78) 63.5,37.32 61.87,35.69 ; v4(71.12,43.56) 76.84,43.56
  Bottom Layer w0.5: v4(27.18,80.9) 28.45,79.63 69.56,79.63 ; v4(46.61,41.78) 69.34,41.78 v4(71.12,43.56) 71.12,78.23 69.72,79.63 69.46,79.63
7.4V: length 155.5
  Top Layer w0.9: P1.2 6.35,20.77 7.75,19.18 v2(16.13,19.18) 17.4,20.45 17.4,23.73 C2.2 17.38,27.64 C3.2 17.34,33.13 U2.3 ; 55.52,55.75 70.74,55.75 72.26,54.23 72.26,48.39 74.55,46.1 76.84,46.1
  Bottom Layer w0.9: v2(16.13,19.18) 20.45,19.18 24,22.73 24,54.1 25.65,55.75 v3(55.37,55.75)
+5V: length 180.1
  Top Layer w0.7: 10.9,76.2 5V.1 12.17,80.01 C1.1 24.07,78.73 25.89,76.91 ; 11.05,75.95 11.18,76.07 13.84,76.07 15.56,74.36 v2(15.56,63.88) ; 15.24,38.92 20.39,38.92 21.72,37.59 21.72,17.91 23.24,16.38 v2(67.06,16.38) ; U2.2 15.24,43.31 15.37,43.43 15.37,46.42 C5.2 v2(15.56,55.5) ; v2(77.85,16.38) 81.41,16.38 81.53,16.26 ; 82.27,16.86 81.21,16.86 80.73,16.38 81.52,15.6 81.53,15.6 ; H11.2 H10.2 81.53,12.45 81.53,16.13 83,17.6 83,20.95 83.71,21.66 C6.2 ; 85.85,21.66 H12.1 90.81,21.59
  Bottom Layer w0.7: v2(15.56,55.5) v2(15.56,63.88) ; v2(67.06,16.38) v2(77.85,16.38)
GND:
  vias: v1(32.64,64.14) v1(35.18,64.14) v1(37.72,64.14) v1(40.26,64.14) v1(42.8,64.14)
(no net):
  vias: v1(4.7,13.34) v1(4.7,10.8) v1(4.7,8.25) v1(7.24,13.34) v1(7.24,10.8) v1(7.24,8.25) v1(9.78,13.34) v1(9.78,10.8) v1(9.78,8.25) v1(12.32,13.34) v1(12.32,10.8) v1(12.32,8.25) v1(14.86,13.34) v1(14.86,10.8) v1(14.86,8.25) v1(17.4,13.34) v1(17.4,10.8) v1(17.4,8.25) v1(19.94,76.84) v1(19.94,74.3) v1(19.94,71.76) v1(19.94,69.22) v1(19.94,66.68) v1(19.95,64.28) v1(19.94,53.98) v1(19.94,51.44) v1(19.94,48.9) v1(19.94,46.36) v1(27.56,38.74) v1(27.56,36.2) v1(27.56,33.66) v1(27.56,31.12) v1(27.56,28.58) v1(27.56,26.04) v1(27.56,23.5) v1(27.56,20.96) v1(45.34,38.74) v1(45.34,36.2) v1(45.34,33.66) v1(45.34,31.12) v1(45.34,28.58) v1(45.34,26.04) v1(45.34,23.5) v1(45.34,20.96) v1(93.6,76.84) v1(93.6,74.3) v1(93.6,71.76) v1(96.14,13.34) v1(96.14,10.8) v1(96.14,8.25) v1(96.14,5.72)
AIN1_L: length 90
  Top Layer w0.254: 36.05,76.91 36.07,76.89 36.07,71.63 37.59,70.1 v1(76.07,70.1) ; v1(86.87,70.1) 86.87,42.67 88.52,41.02 92.08,41.02
  Bottom Layer w0.254: v1(86.87,70.1) v1(76.07,70.1)
AIN2_L: length 85.5
  Top Layer w0.254: 38.59,76.91 38.61,76.89 38.61,73.41 39.88,72.14 v1(76.07,72.14) ; v1(88.52,72.14) 88.52,44.58 89.54,43.56 92.08,43.56
  Bottom Layer w0.254: v1(88.52,72.14) v1(76.07,72.14)
AO2_L: length 149.5
  Top Layer w0.254: P4.2 34.29,6.13 34.29,8.38 35.18,9.27 70.49,9.27 71.25,10.03 71.25,35.18 72.01,35.94 79.63,35.94 80.65,36.96 v1(80.64,84.96) ; P2.2 57.07,85.55 57.66,84.96 v1(76.45,84.96)
  Bottom Layer w0.254: 75.69,84.96 v1(80.64,84.96)
BIN1_L: length 103.4
  Top Layer w0.254: 33.51,76.91 33.53,76.89 33.53,69.98 34.8,68.71 v1(76.07,68.71) ; 92.08,35.94 94.11,35.94 94.49,36.32 v1(94.49,68.71)
  Bottom Layer w0.254: v1(94.49,68.71) v1(76.07,68.71)
BIN2_L: length 111.3
  Top Layer w0.254: 30.97,76.91 30.86,76.8 30.86,68.2 32.26,66.8 v1(76.07,66.8) ; 92.08,33.4 95,33.4 96.01,34.42 v1(96.01,66.84)
  Bottom Layer w0.254: v1(76.07,66.8) 95.98,66.8 v1(96.01,66.84)
BLK: length 43.4
  Top Layer w0.254: 48.77,51.69 48.77,48.51 49.53,47.75 58.04,47.75 58.93,46.86 v1(58.93,29.97) ; v1(58.93,20.46) 61.86,20.46 61.87,20.45
  Bottom Layer w0.254: v1(58.93,29.97) v1(58.93,20.46)
BO1_L: length 154.8
  Top Layer w0.254: P3.2 28.75,82.63 29.85,81.53 v1(76.45,81.53) ; P5.2 71.88,6.1 73.66,7.87 73.66,29.85 74.68,30.86 83.31,30.86 83.79,31.34 v1(83.79,81.53)
  Bottom Layer w0.254: v1(76.45,81.53) v1(83.79,81.53)
BO2_L: length 151.9
  Top Layer w0.254: P3.1 33.75,84.1 34.8,83.06 v1(76.45,83.06) ; P5.1 57.53,6.13 57.53,7.24 57.91,7.62 71.37,7.62 72.52,8.76 72.52,32.39 73.53,33.4 76.84,33.4 ; 76.84,33.27 76.96,33.4 81.28,33.4 82.33,34.46 v1(82.33,83.06)
  Bottom Layer w0.254: v1(76.45,83.06) v1(82.33,83.06)
C13: length 71.4
  Top Layer w0.254: v1(41.15,48.77) 41.15,51.69 ; 78.36,21.59 v1(75.56,21.59)
  Bottom Layer w0.254: v1(41.15,48.77) 41.15,19.94 42.42,18.67 65.66,18.67 66.55,19.56 66.55,20.83 67.31,21.59 v1(75.56,21.59)
C15: length 73.6
  Top Layer w0.254: v1(38.61,48.77) 38.61,51.69 ; 78.36,19.05 v1(75.57,19.05)
  Bottom Layer w0.254: v1(38.61,48.77) 38.61,18.92 39.88,17.65 67.44,17.65 68.83,19.05 v1(75.57,19.05)
CS: length 53.4
  Top Layer w0.254: 36.07,51.69 36.07,46.86 36.83,46.1 56.52,46.1 57.66,44.96 v1(57.66,29.97) ; v1(57.66,22.99) 61.87,22.99
  Bottom Layer w0.254: v1(57.66,29.97) v1(57.66,22.99)
DC: length 53.5
  Top Layer w0.254: 33.53,51.69 33.53,45.34 34.16,44.7 55.37,44.7 56.52,43.56 v1(56.52,29.97) ; v1(56.52,25.53) 61.87,25.53
  Bottom Layer w0.254: v1(56.52,29.97) v1(56.52,25.53)
IO25: length 78.2
  Top Layer w0.254: 43.67,76.91 43.69,76.89 43.69,75.06 44.83,73.91 v1(76.07,73.91) ; v1(89.66,73.91) 89.66,46.74 90.3,46.1 92.08,46.1
  Bottom Layer w0.254: v1(89.66,73.91) v1(76.07,73.91)
IO26: length 111.9
  Top Layer w0.254: 41.13,76.91 41.15,76.93 41.15,78.87 41.91,79.63 v1(76.07,79.63) ; 92.08,30.86 96.14,30.86 97.41,32.13 v1(97.41,79.63)
  Bottom Layer w0.254: v1(97.41,79.63) v1(76.07,79.63)
IO33: length 82.6
  Top Layer w0.254: 46.21,76.91 46.23,76.89 46.23,76.07 46.99,75.31 v1(76.05,75.31) ; v1(85.22,75.31) 85.22,40.51 87.25,38.48 92.08,38.48
  Bottom Layer w0.254: v1(85.22,75.31) v1(76.05,75.31)
AO1_L: length 144.9
  Top Layer w0.254: P4.1 29.21,6.13 29.21,9.91 30.35,11.05 68.83,11.05 69.85,12.07 69.85,37.34 70.99,38.48 78.11,38.48 78.99,39.37 78.99,86.36 78.11,87.25 P2.1
C2: length 26.1
  Top Layer w0.254: H10.1 83.19,6.78 83.86,6.1 94.11,6.1 95.25,7.24 95.25,19.05
C14: length 20.5
  Top Layer w0.254: H11.1 92.33,8.26 93.22,9.14 93.22,21.34 93.47,21.59 95.25,21.59
IO5: length 49.4
  Top Layer w0.254: H15.1 5.59,59.56 6.6,58.55 42.67,58.55 43.69,57.53 43.69,51.69
IO15: length 52.9
  Top Layer w0.254: 30.99,51.69 30.99,44.32 32,43.31 54.48,43.31 55.25,42.55 55.25,28.96 56.13,28.07 61.87,28.07
IO18: length 49.5
  Top Layer w0.254: H15.2 8.13,60.71 9.02,59.82 45.34,59.82 46.23,58.93 46.23,51.69
IO21: length 52.3
  Top Layer w0.254: H15.3 10.67,61.85 11.43,61.09 50.67,61.09 51.31,60.45 51.31,51.69
IO22: length 27.8
  Top Layer w0.254: 58.93,51.69 58.93,48.39 59.69,47.63 64.9,47.63 65.79,46.74 65.79,34.04 64.9,33.15 61.87,33.15
IO23: length 30.3
  Top Layer w0.254: 61.47,51.69 61.47,50.04 62.36,49.15 66.29,49.15 66.93,48.51 66.93,31.37 66.17,30.61 61.87,30.61

## Copper pours and planes (outline as drawn; the poured copper is in the pictures)
GND on Top Layer: -5.46,99.7 103.76,99.7 103.76,-6.98 -5.46,-6.98
GND on Bottom Layer: -9.27,101.22 107.82,101.22 107.82,-3.56 -9.27,-3.56
GND on Bottom Layer: -18.03,102.11 108.58,102.11 108.58,-9.78 -18.03,-9.78

## Text on the board
Top Silkscreen Layer: 5 | 18 | 21 | 13 | 15 | Y | X | GND | 5V | x | - | + | AMW | Car | Author: | MYRY | Cam Area

# Board PCB1_1
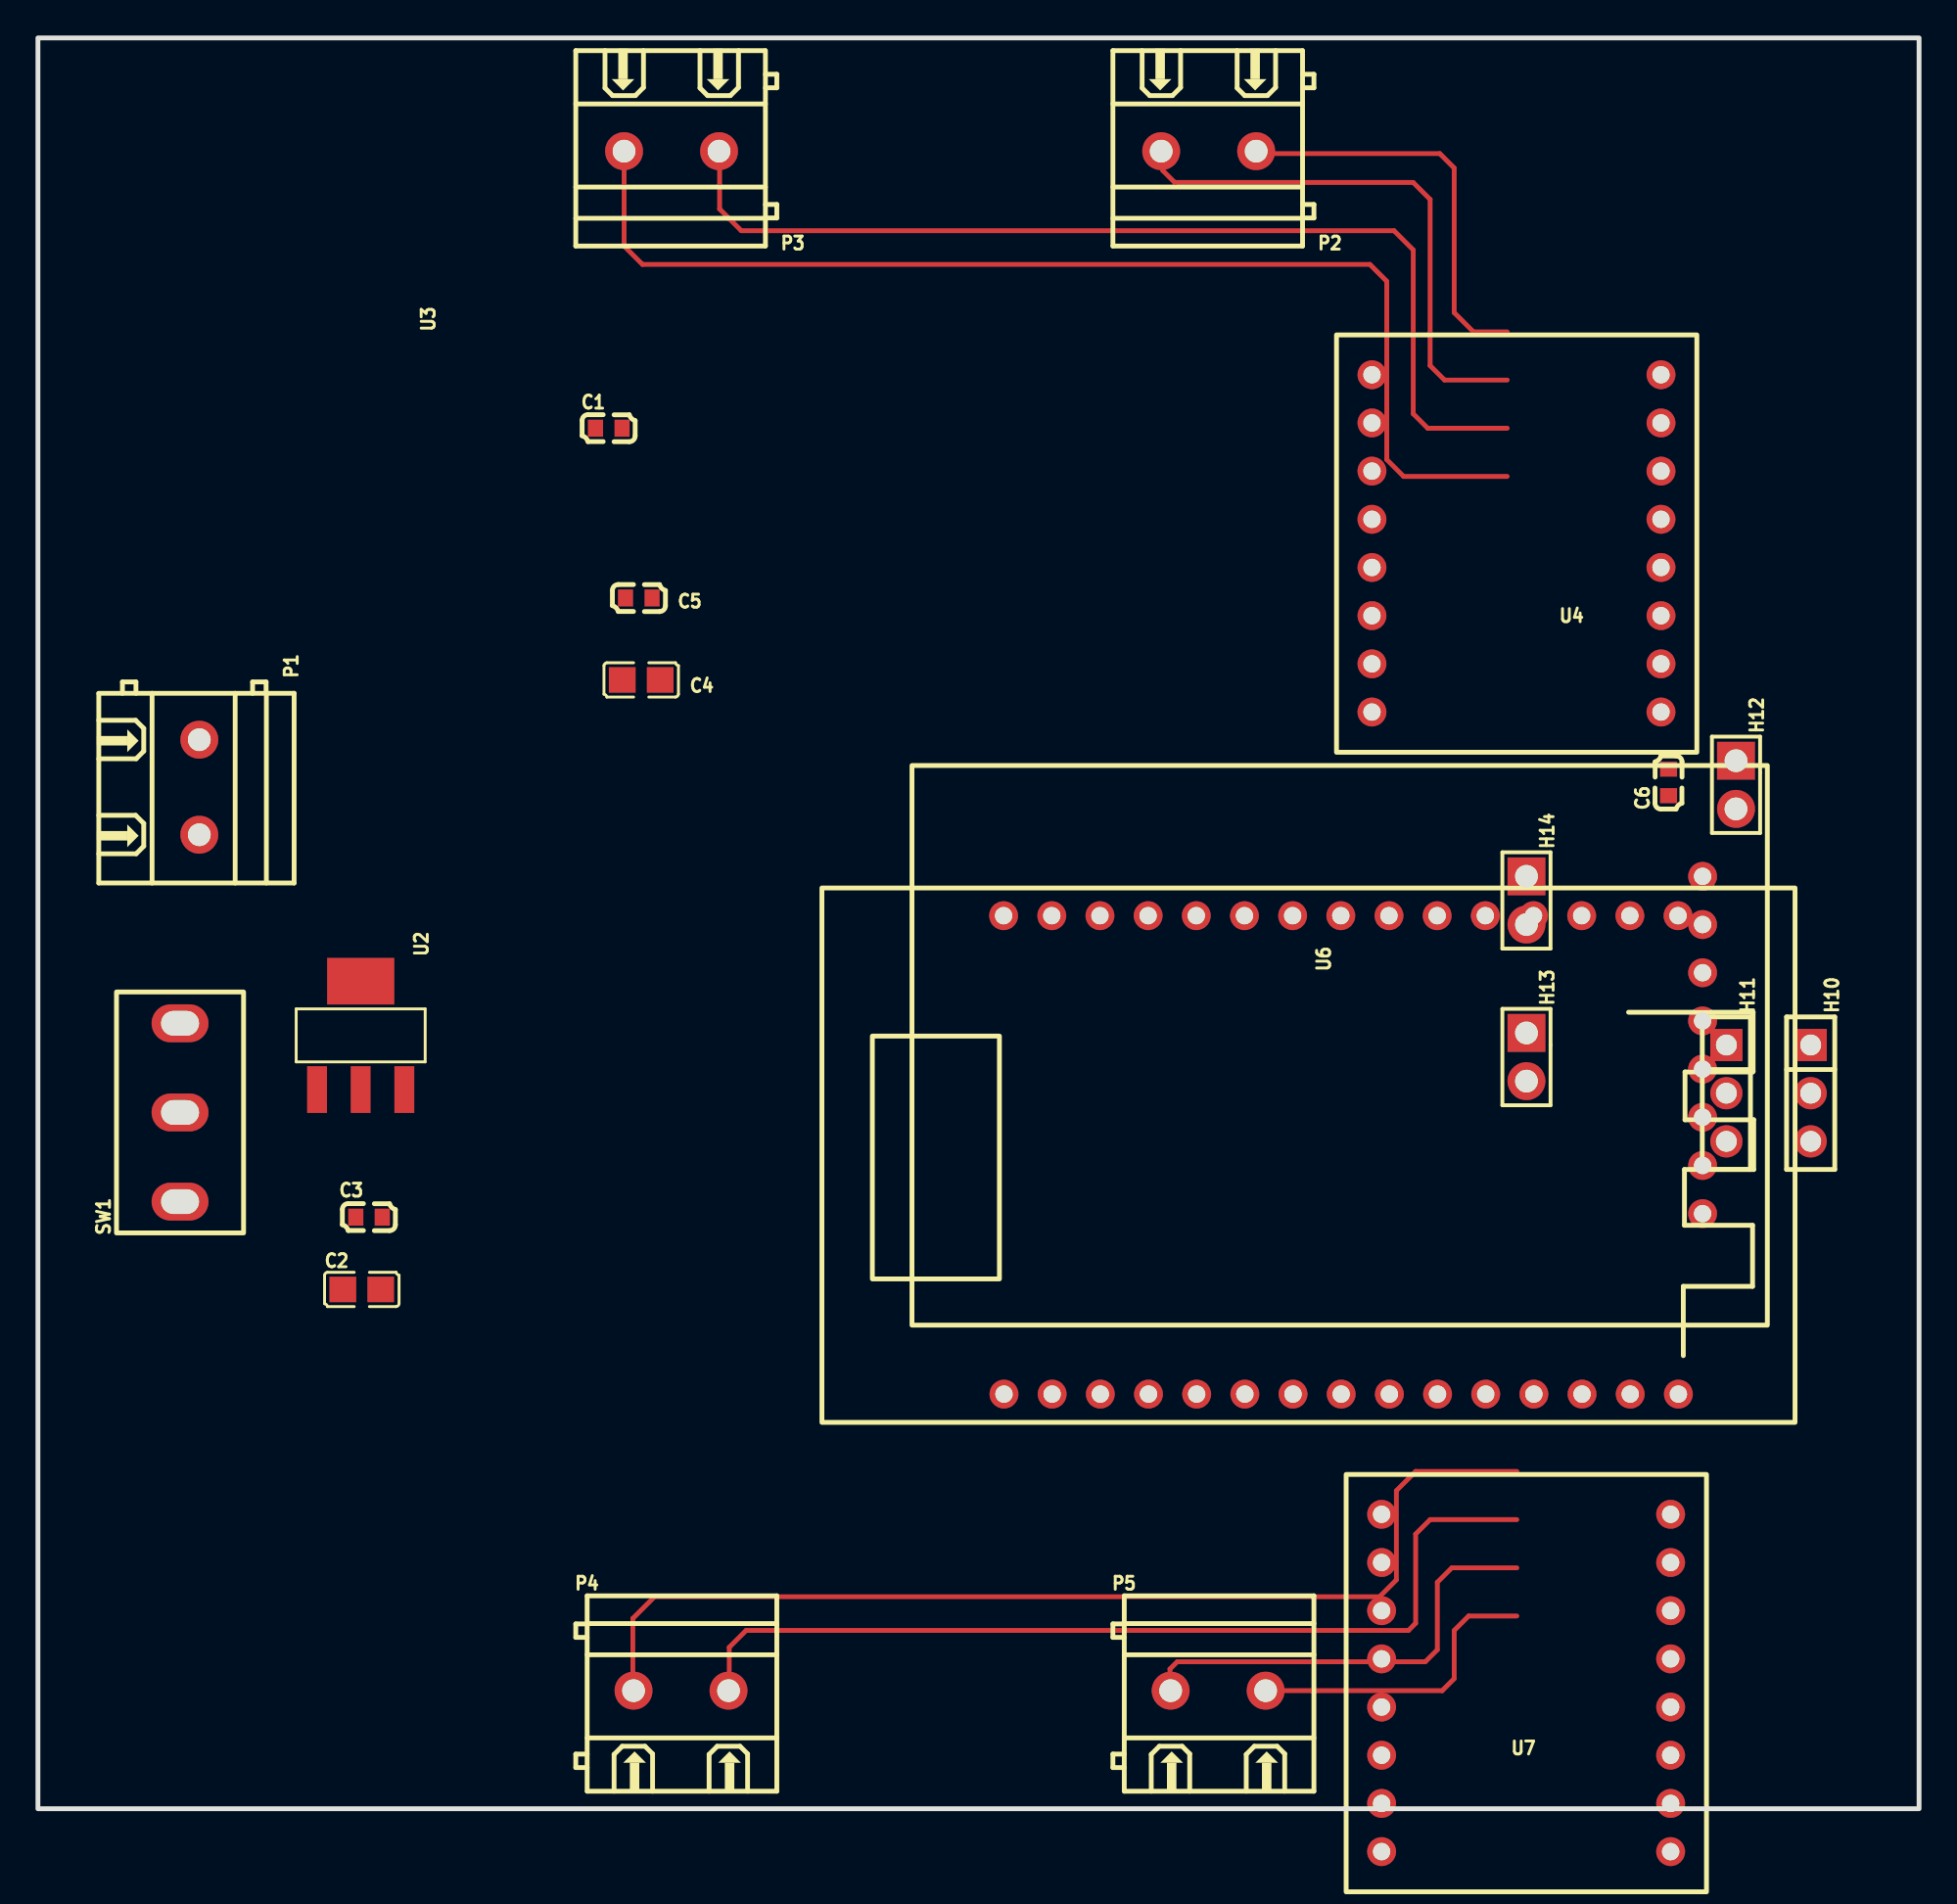
[diagram p4: board, top side]
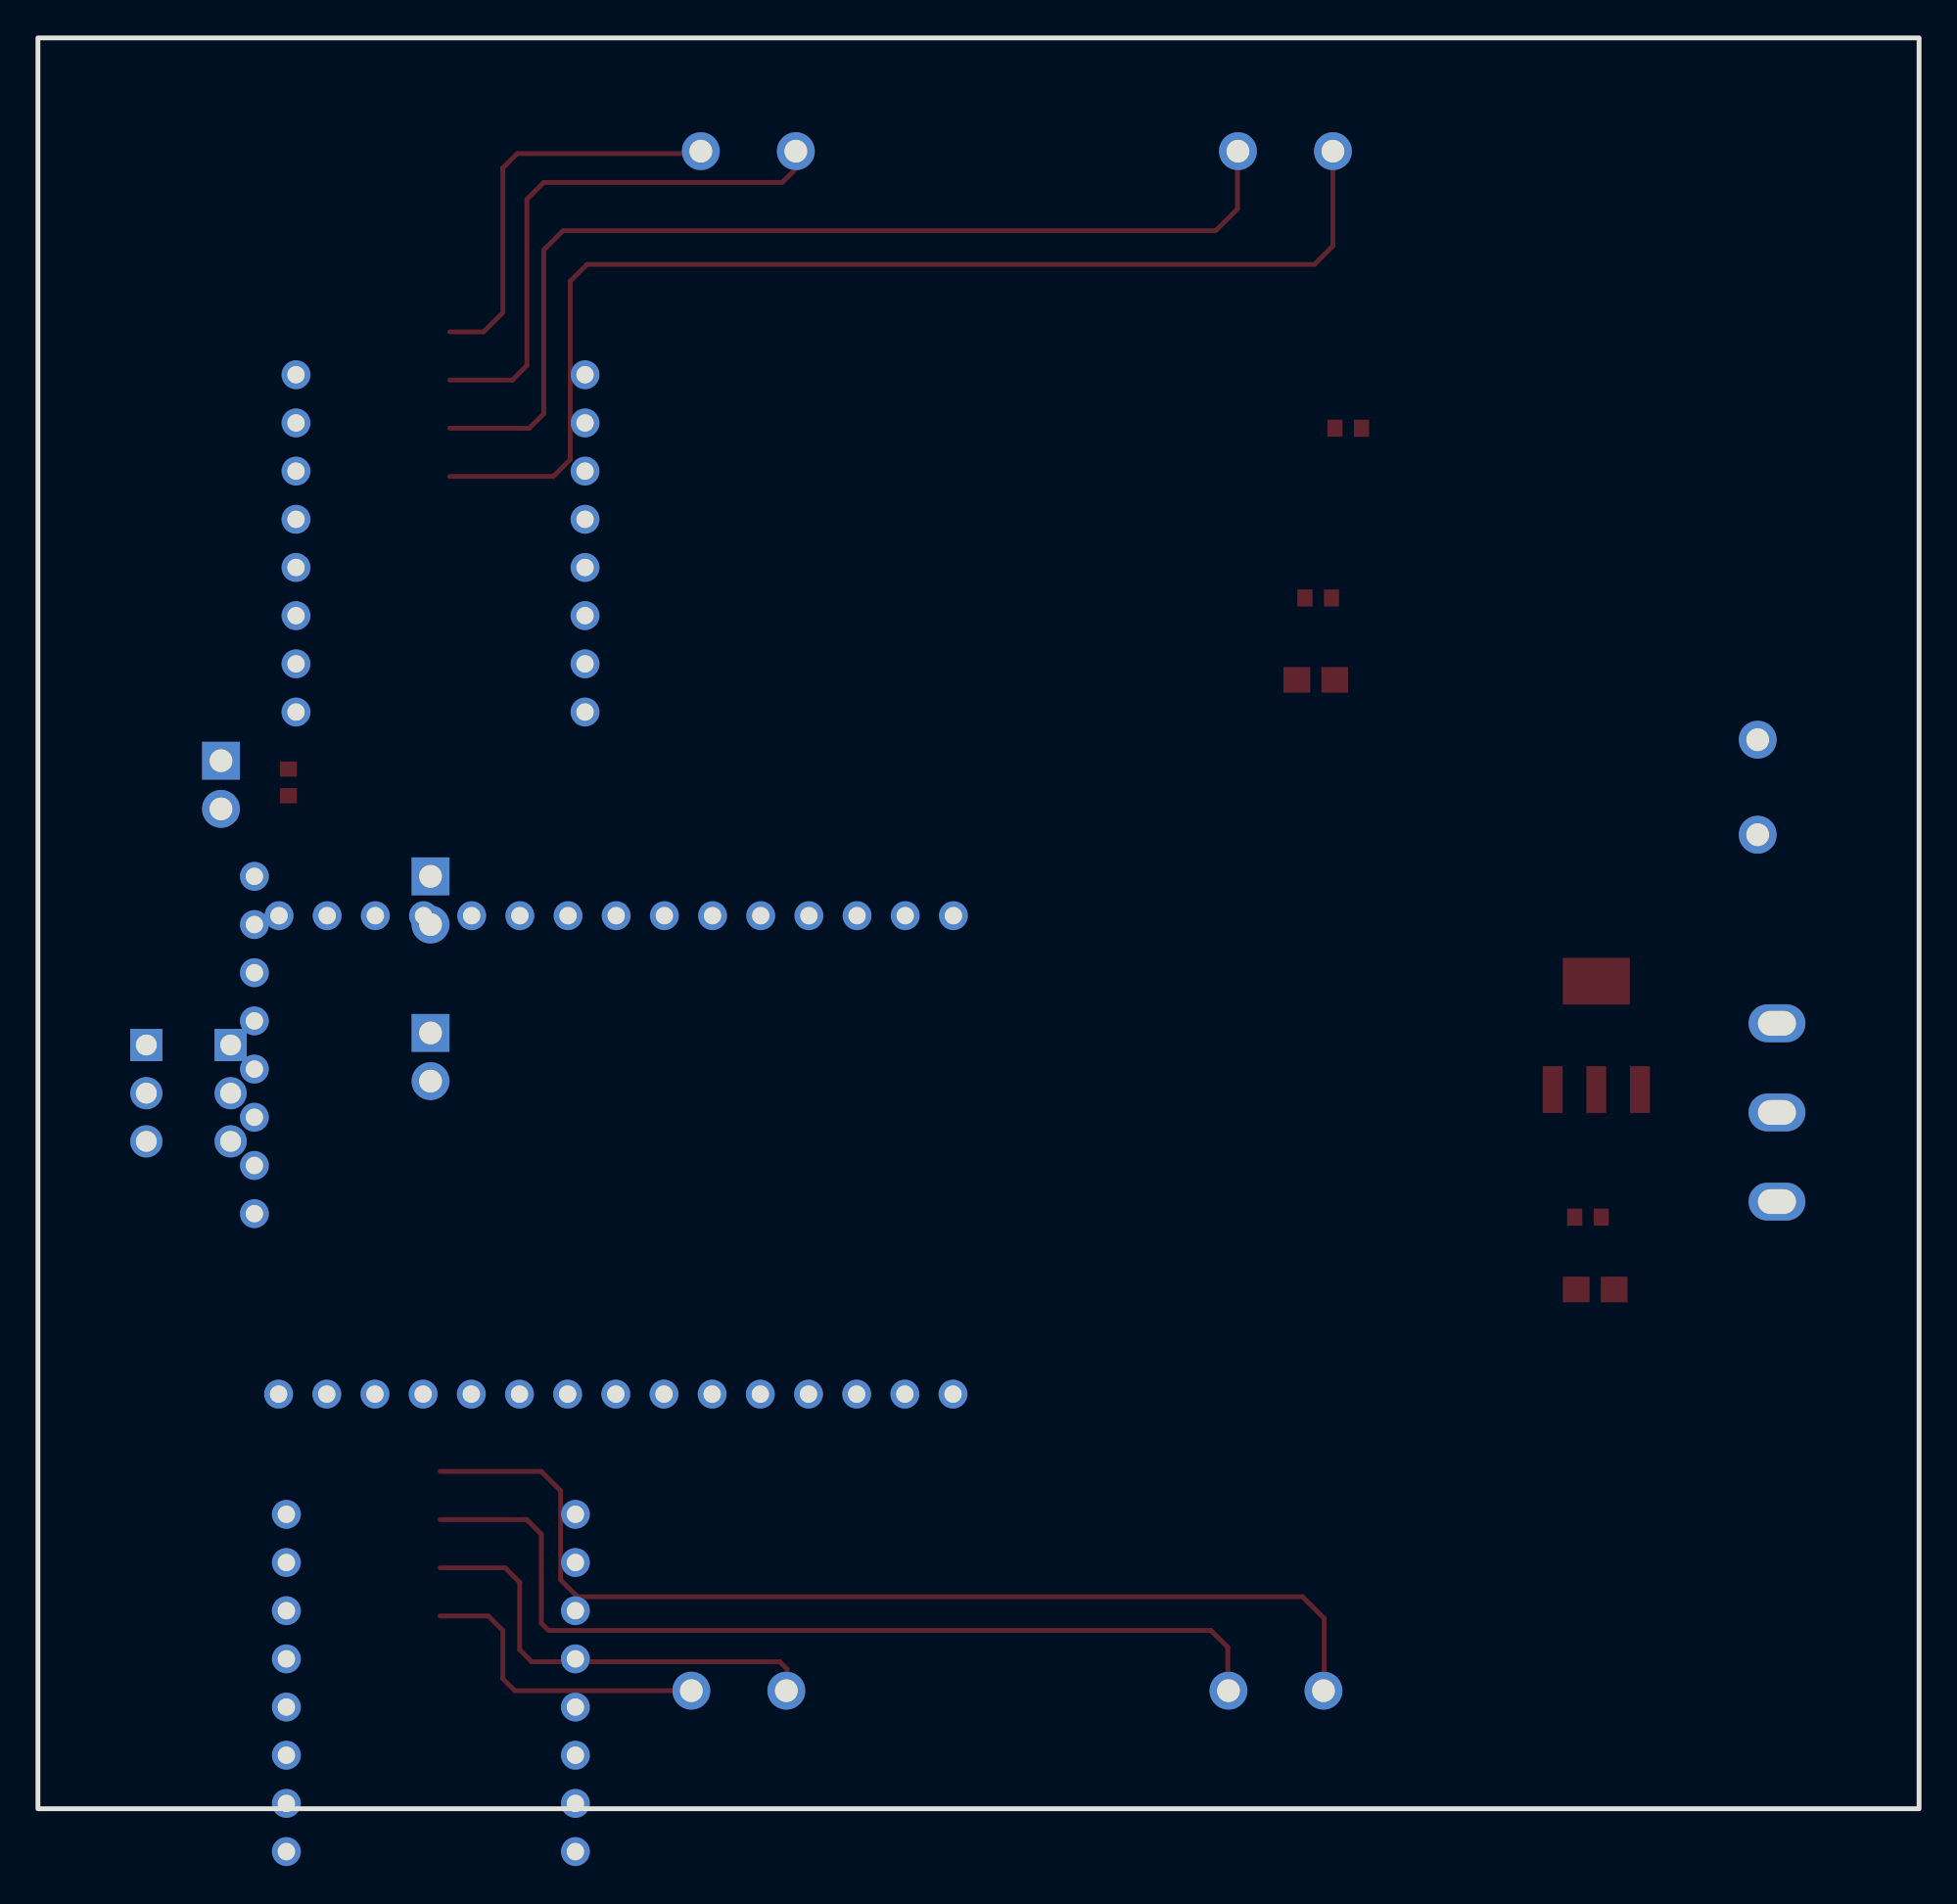
[diagram p5: board, bottom side, seen from below]

Outline 99.19 x 93.34 mm; copper layers: Top Layer, Bottom Layer. Coordinates in mm from the lower left corner of the outline.
Outline path: rectangle 0,93.34 99.19,0
Stack: Top Layer 0.035mm / Dielectric1 1.51mm FR4 er 4.5 / Bottom Layer 0.035mm

## Design rules (mm)
template: JLCPCB Capability(Two Layers Board)
spacing copperThickness1oz (default): track to track 0.102, other pairs 0.152 to 0.3
spacing copperThickness2oz: track to track 0.203, other pairs 0.152 to 0.3
track width copperThickness1oz (default): min 0.127, default 0.254, max 2.54
track width copperThickness2oz: min 0.203, default 0.254, max 2.54
differential pair differentialPair (default): width min 0.127, default 0.254, max 2.54; gap min 0.152, default 0.152
via viaSize (default): diameter min 0.5, default 0.61, max 10; hole min 0.3, default 0.305, max 6.3

## Placement (name value [footprint] x y rotation side)
C1  100nF  [C0603]  30.1 72.77 0 top
C2  10uF  [C0805]  17.08 27.37 0 top
C3  100nF  [C0603]  17.46 31.18 0 top
C4  10uF  [C0805]  31.81 59.5 180 top
C5  100nF  [C0603]  31.68 63.82 180 top
C6  100nF  [C0603]  85.98 54.1 90 top
H10  PZ254V-11-03P  [HDR-TH_3P-P2.54-V-M]  93.47 37.72 270 top
H11  PZ254V-11-03P  [HDR-TH_3P-P2.54-V-M]  89.03 37.72 270 top
H12  PZ254V-11-02P  [HDR-TH_2P-P2.54-V-M]  89.53 53.97 270 top
H13  PZ254V-11-02P  [HDR-TH_2P-P2.54-V-M]  78.49 39.62 270 top
H14  PZ254V-11-02P  [HDR-TH_2P-P2.54-V-M]  78.49 47.88 270 top
P1  WJ128V-5.0-2P  [CONN-TH_2P-P5.00_WJ128V-5.0-2P]  8.51 53.85 270 top
P2  WJ128V-5.0-2P  [CONN-TH_2P-P5.00_WJ128V-5.0-2P]  61.73 87.38 180 top
P3  WJ128V-5.0-2P  [CONN-TH_2P-P5.00_WJ128V-5.0-2P]  33.41 87.38 180 top
P4  WJ128V-5.0-2P  [CONN-TH_2P-P5.00_WJ128V-5.0-2P]  33.91 6.22 0 top
P5  WJ128V-5.0-2P  [CONN-TH_2P-P5.00_WJ128V-5.0-2P]  62.23 6.22 0 top
SW1  SS-12D10L5  [SW-TH_SS-12D10L5]  7.49 36.7 90 top
U2  AMS1117-5.0  [SOT-223_L6.5-W3.5-P2.30-LS7.0-BR]  17.02 40.77 270 top
U3  -  [ESP32_WROOM_32]  58.55 51.82 270 top
U4  -  [TB6612fng]  77.47 67.69 0 top
U6  -  [ST7735]  65.02 38.35 270 top
U7  -  [TB6612fng]  77.98 7.62 0 top

## Footprints (pads in the part's own frame, mm; a bottom-side part is the same pattern mirrored in y, then rotated)
C0603
  rect 0.8x0.9 smd: 1(-0.7,0) 2(0.7,0)
C0805
  rect 1.41x1.35 smd: 1(-1,0) 2(1,0)
CONN-TH_2P-P5.00_WJ128V-5.0-2P
  round 2 hole 1.2: 1(-2.505,0) 2(2.505,0)
ESP32_WROOM_32
  round 1.524 hole 0.914: 1(4.74,27.93) 2(4.74,25.39) 3(4.74,22.85) 4(4.74,20.31) 5(4.74,17.77) 6(4.74,15.23) 7(4.74,12.69) 8(4.74,10.15) 9(4.74,7.61) 10(4.74,5.07) 11(4.74,2.53) 12(4.74,-0.01) 13(4.74,-2.55) 14(4.74,-5.09) 15(4.74,-7.63) 16(29.96,27.95) 17(29.96,25.41) 18(29.96,22.87) 19(29.96,20.33) 20(29.96,17.79) 21(29.96,15.25) 22(29.96,12.71) 23(29.96,10.17) 24(29.96,7.63) 25(29.96,5.09) 26(29.96,2.55) 27(29.96,0.01) 28(29.96,-2.53) 29(29.96,-5.07) 30(29.96,-7.61)
HDR-TH_2P-P2.54-V-M
  rect 2x2 hole 1.2: 1(-1.27,0)
  round 2 hole 1.2: 2(1.27,0)
HDR-TH_3P-P2.54-V-M
  rect 1.7x1.7 hole 1.1: 1(-2.54,0)
  round 1.7 hole 1.1: 2(0,0) 3(2.54,0)
SOT-223_L6.5-W3.5-P2.30-LS7.0-BR
  rect 2.465x1.05 smd: 1(2.857,-2.3) 2(2.857,0) 3(2.857,2.3)
  rect 2.465x3.54 smd: 4(-2.857,0)
ST7735
  round 1.524 hole 0.914: 1(-10.795,22.749) 2(-8.255,22.749) 3(-5.715,22.749) 4(-3.175,22.749) 5(6.985,22.749) 6(4.445,22.749) 7(1.905,22.749) 8(-0.635,22.749)
SW-TH_SS-12D10L5
  oval 2x3 hole 1.3x2: 1(-4.7,0) 2(0,0) 3(4.7,0)
TB6612fng
  round 1.524 hole 0.914: 1(-7.13,7.9) 2(-7.13,5.36) 3(-7.13,2.82) 4(-7.13,0.28) 5(-7.13,-2.26) 6(-7.13,-4.8) 7(-7.13,-7.34) 8(-7.13,-9.88) 9(8.11,-9.88) 10(8.11,-7.34) 11(8.11,-4.8) 12(8.11,-2.26) 13(8.11,0.28) 14(8.11,2.82) 15(8.11,5.36) 16(8.11,7.9)

## Nets
As in the schematic, except:
AIN1: U3.11 U3.24 U4.14 U7.14
AIN2: U3.10 U3.23 U4.15 U7.15
BIN1: U3.6 U3.12 U4.12 U7.12
BIN2: U3.13 U3.26 U4.11 U7.11
IO25: U3.4 U3.8 U4.16 U7.16
IO26: U3.5 U3.9 U4.10 U7.10

Pads without a net: SW1 3; U3 1 2 3 27 28

## Routing (per net, layer and track width the routed paths; a pad name or vN(x,y) marks a point on that pad's centre or on a via; arc(x,y) is an arc through that point)
AO1_L: length 21.6
  Top Layer w0.254: P2.1 64.36,87.25 73.91,87.25 74.68,86.49 74.68,78.87 75.69,77.85 77.47,77.85
AO1_R: length 56.4
  Top Layer w0.254: P4.1 31.37,6.26 31.37,10.03 32.51,11.18 70.74,11.18 71.63,12.06 71.63,16.76 72.64,17.78 77.98,17.78
AO2_L: length 28.9
  Top Layer w0.254: P2.2 59.31,87.29 59.31,86.36 59.94,85.72 72.52,85.72 73.41,84.84 73.41,76.07 74.17,75.31 77.47,75.31
AO2_R: length 49.4
  Top Layer w0.254: P4.2 36.45,6.26 36.45,8.51 37.34,9.4 72.26,9.4 72.64,9.78 72.64,14.48 73.41,15.24 77.98,15.24
BO1_L: length 62.1
  Top Layer w0.254: P3.2 30.91,87.37 30.91,82.38 31.88,81.41 70.23,81.41 71.12,80.52 71.12,71.12 72.01,70.23 77.47,70.23
BO1_R: length 16.4
  Top Layer w0.254: P5.2 74.04,6.22 74.68,6.86 74.68,9.4 75.44,10.16 77.98,10.16
BO2_L: length 54.4
  Top Layer w0.254: P3.1 35.94,87.35 35.94,84.33 37.08,83.18 71.5,83.18 72.52,82.17 72.52,73.53 73.28,72.77 77.47,72.77
BO2_R: length 23.7
  Top Layer w0.254: P5.1 59.69,6.26 59.69,7.37 60.07,7.75 73.15,7.75 73.79,8.38 73.79,11.94 74.55,12.7 77.98,12.7
